# EAGLE design easy_bee_Itsybitsy (EAGLE 9.5.2)
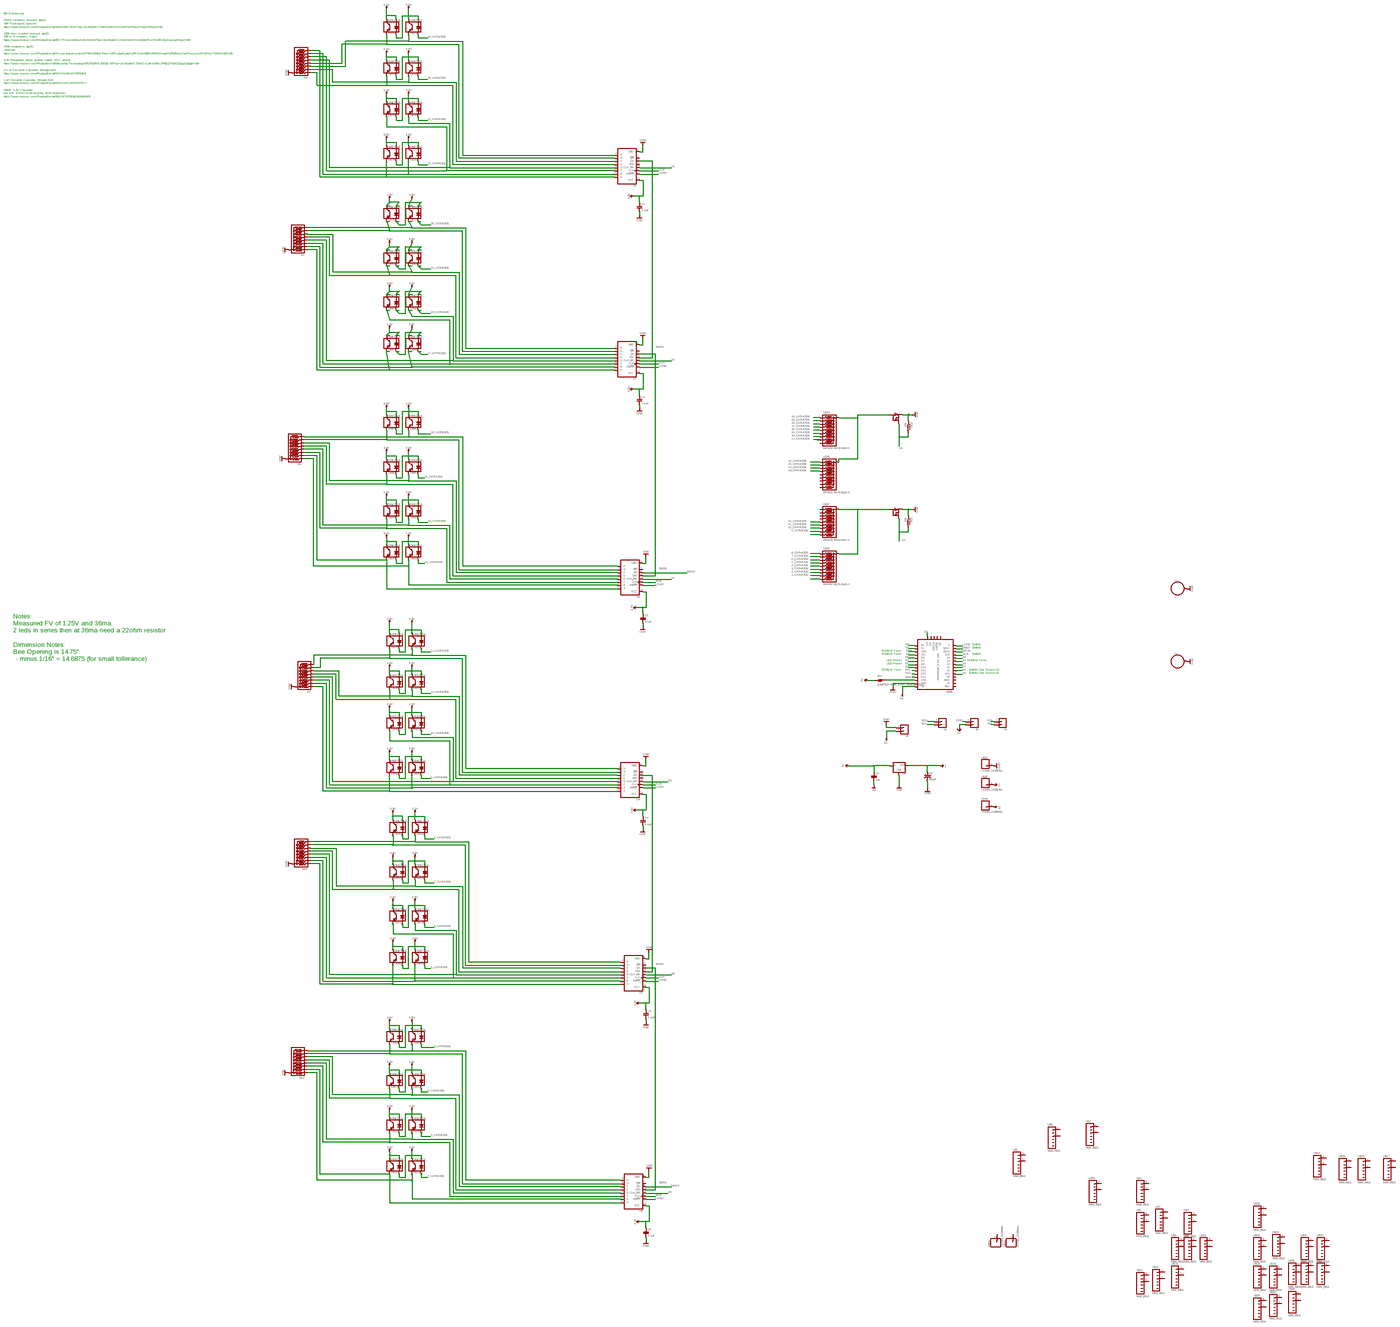
[diagram p0: schematic, sheet 1, overview]
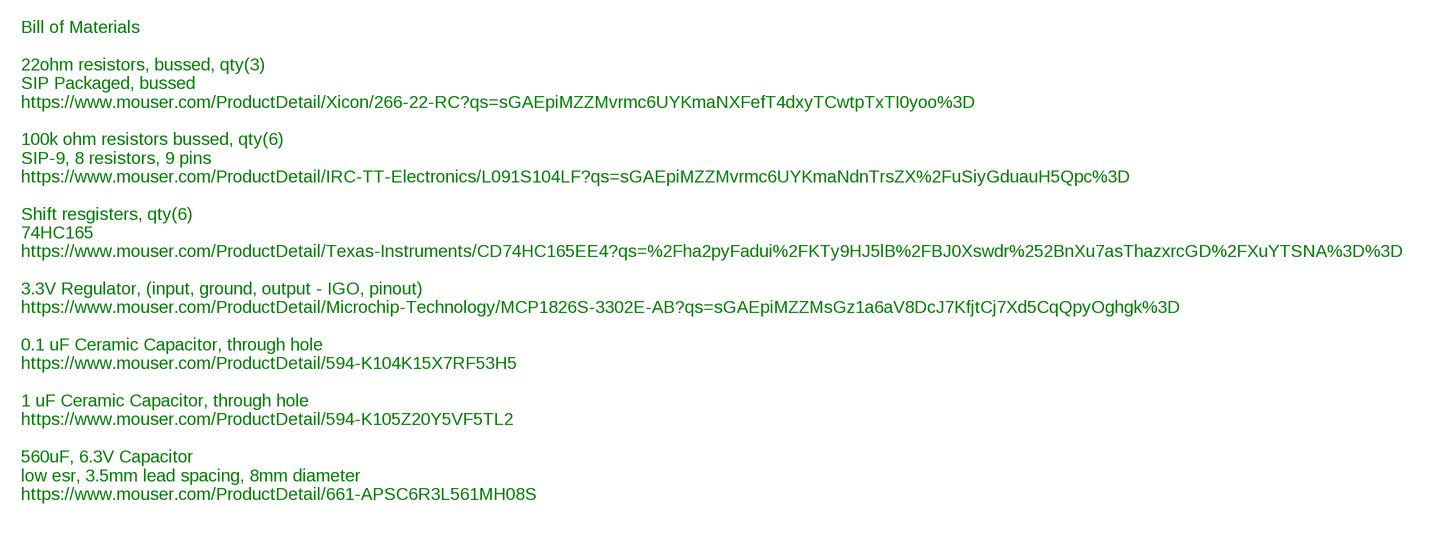
[diagram p1: schematic, sheet 1, part 1 of 5]
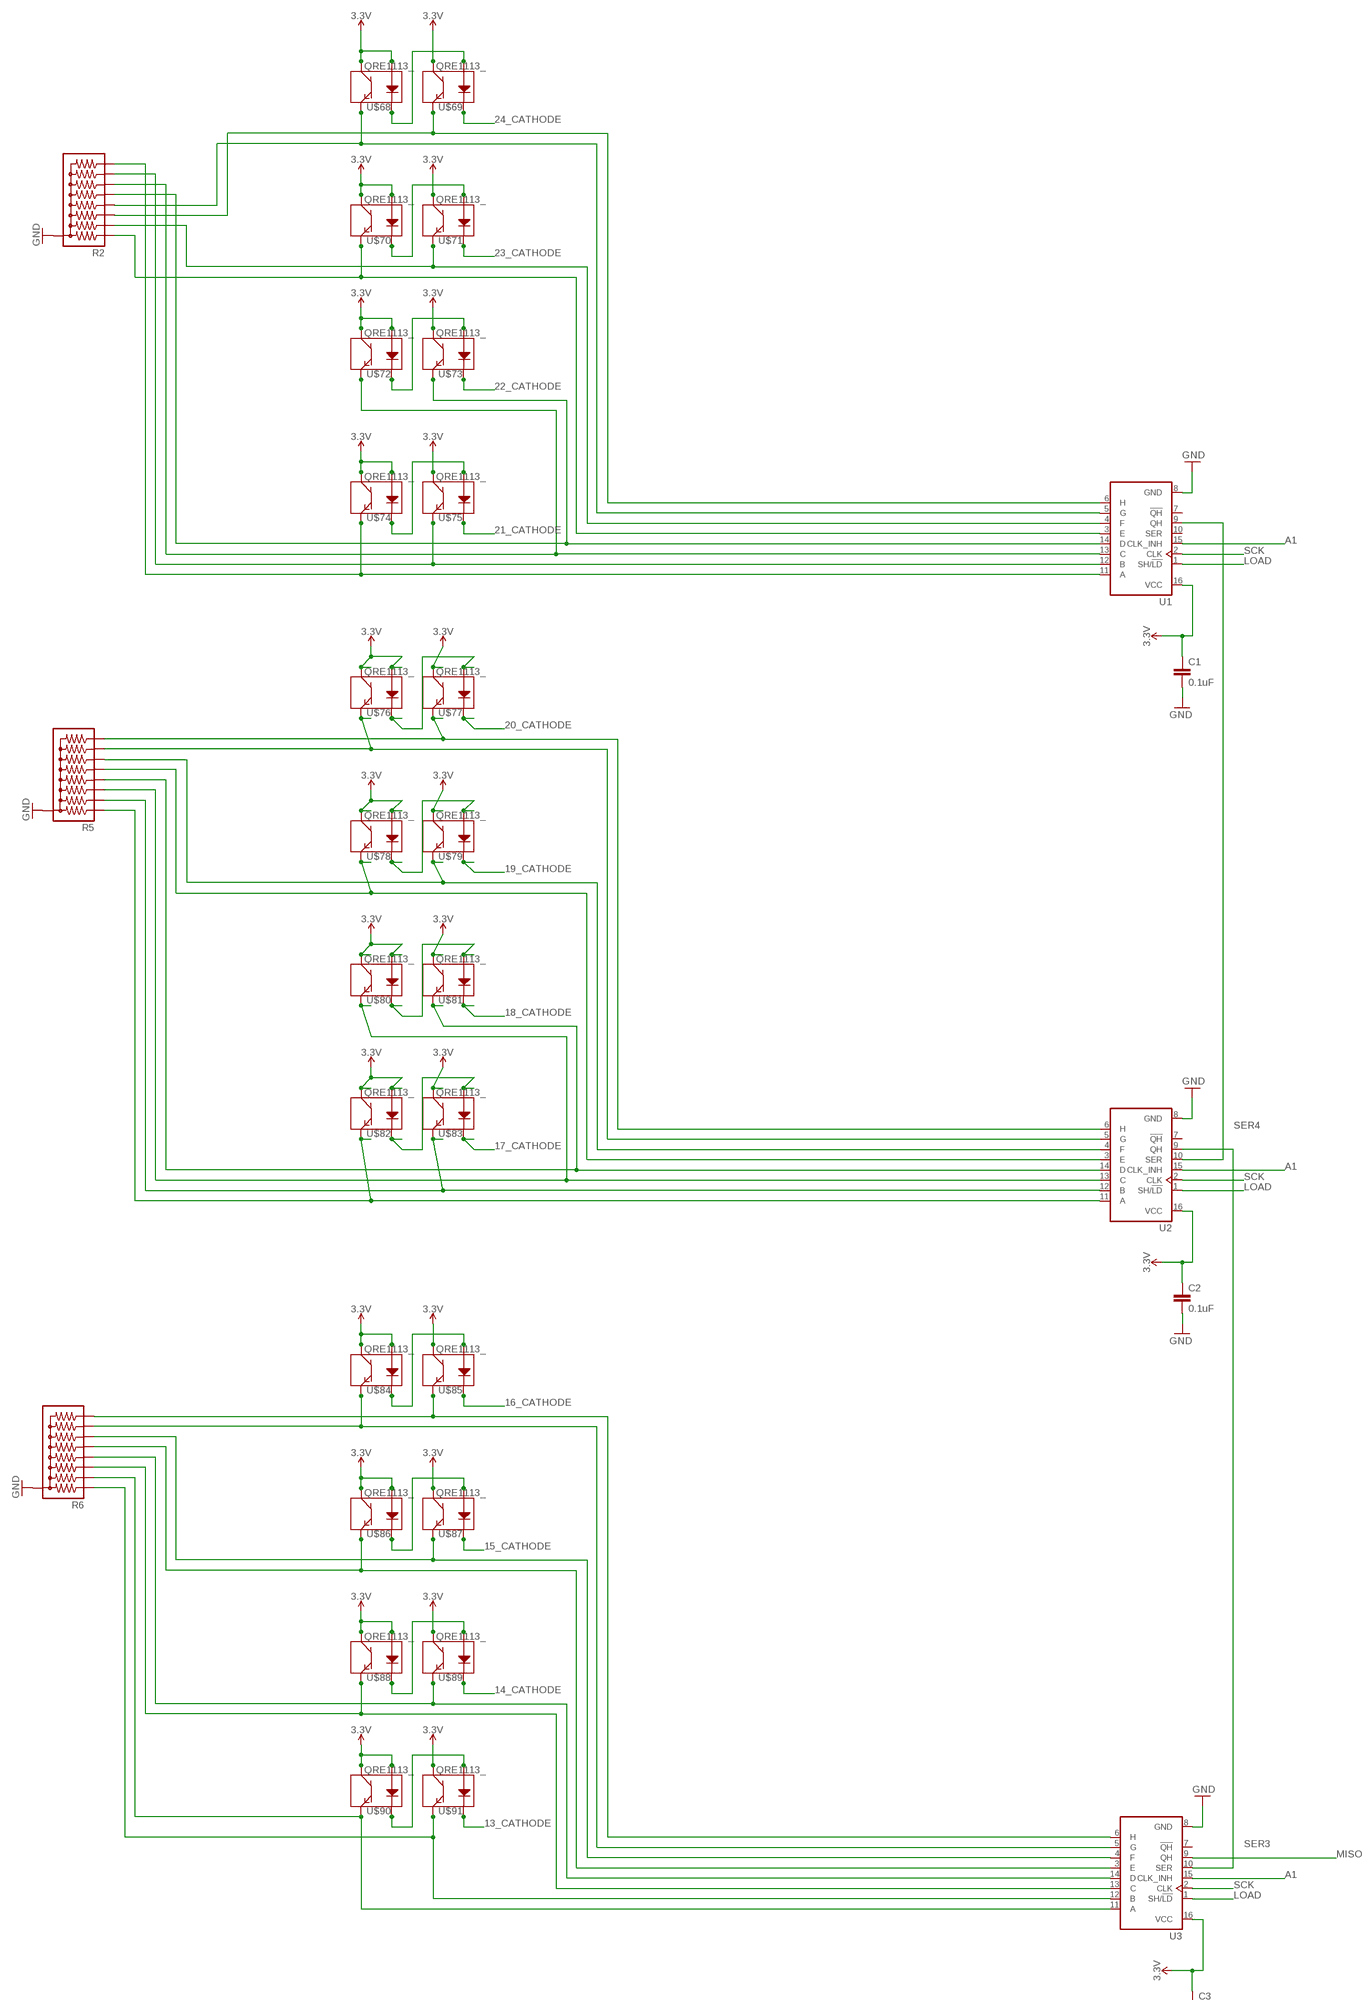
[diagram p2: schematic, sheet 1, part 2 of 5]
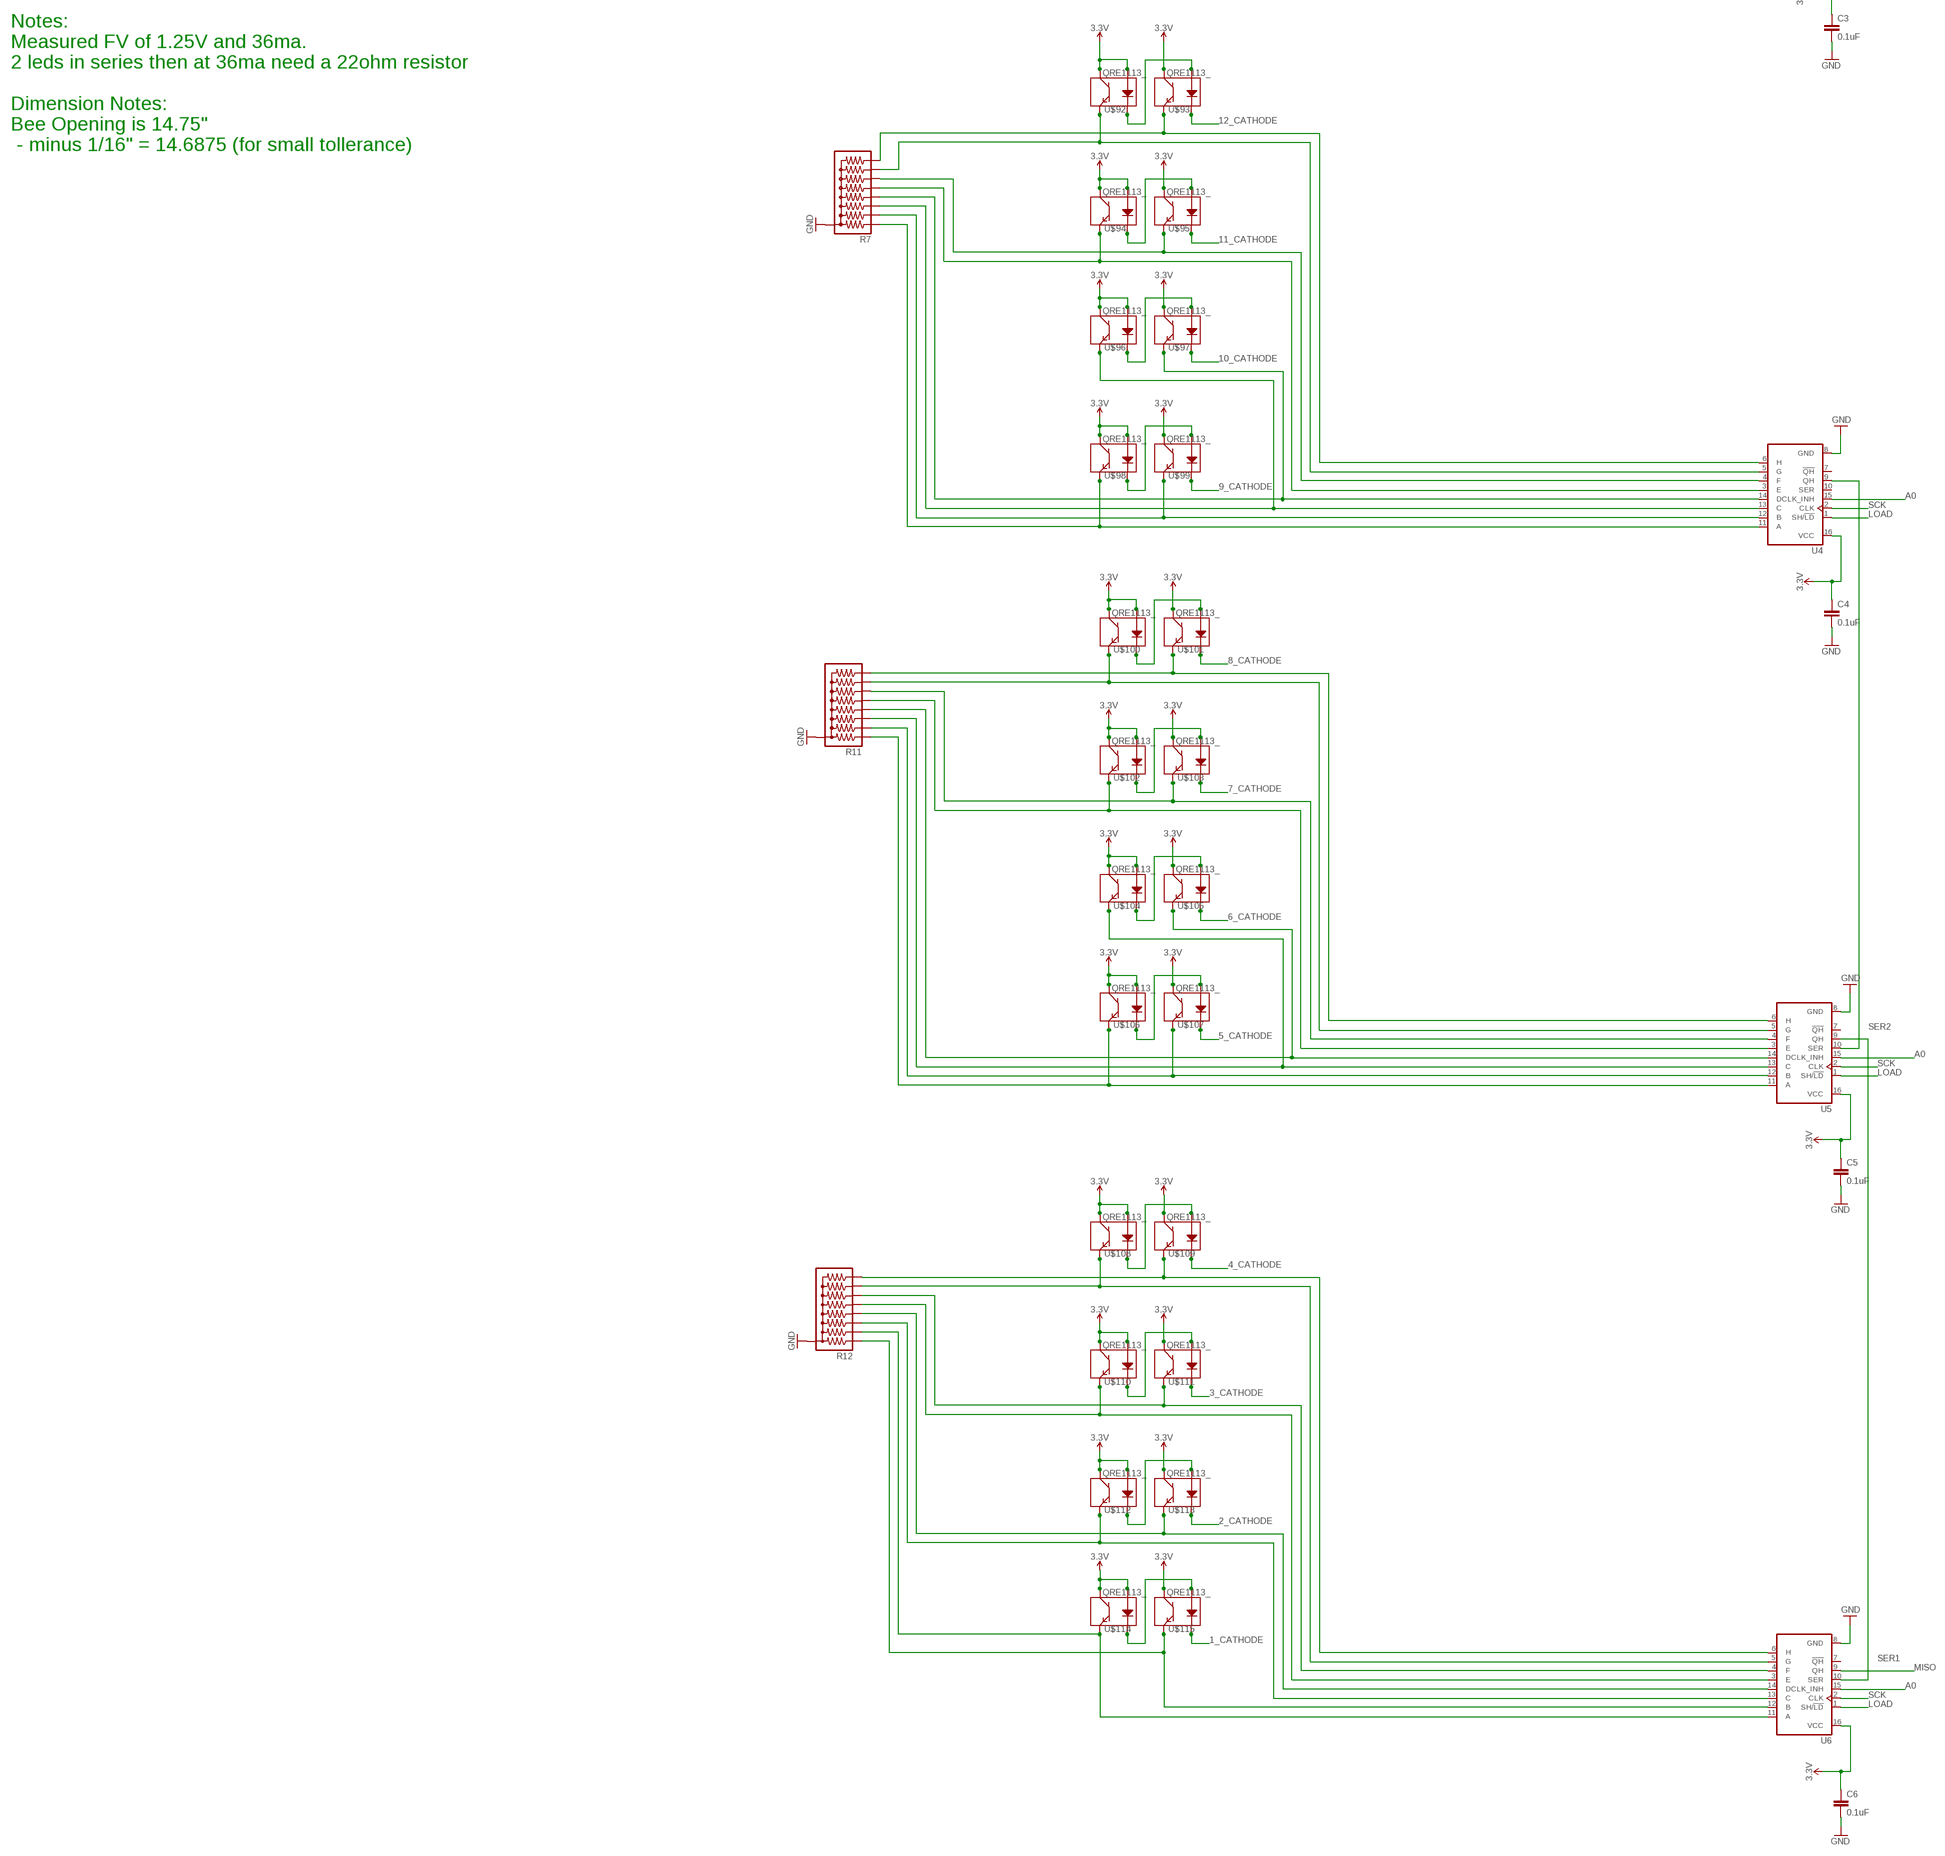
[diagram p3: schematic, sheet 1, part 3 of 5]
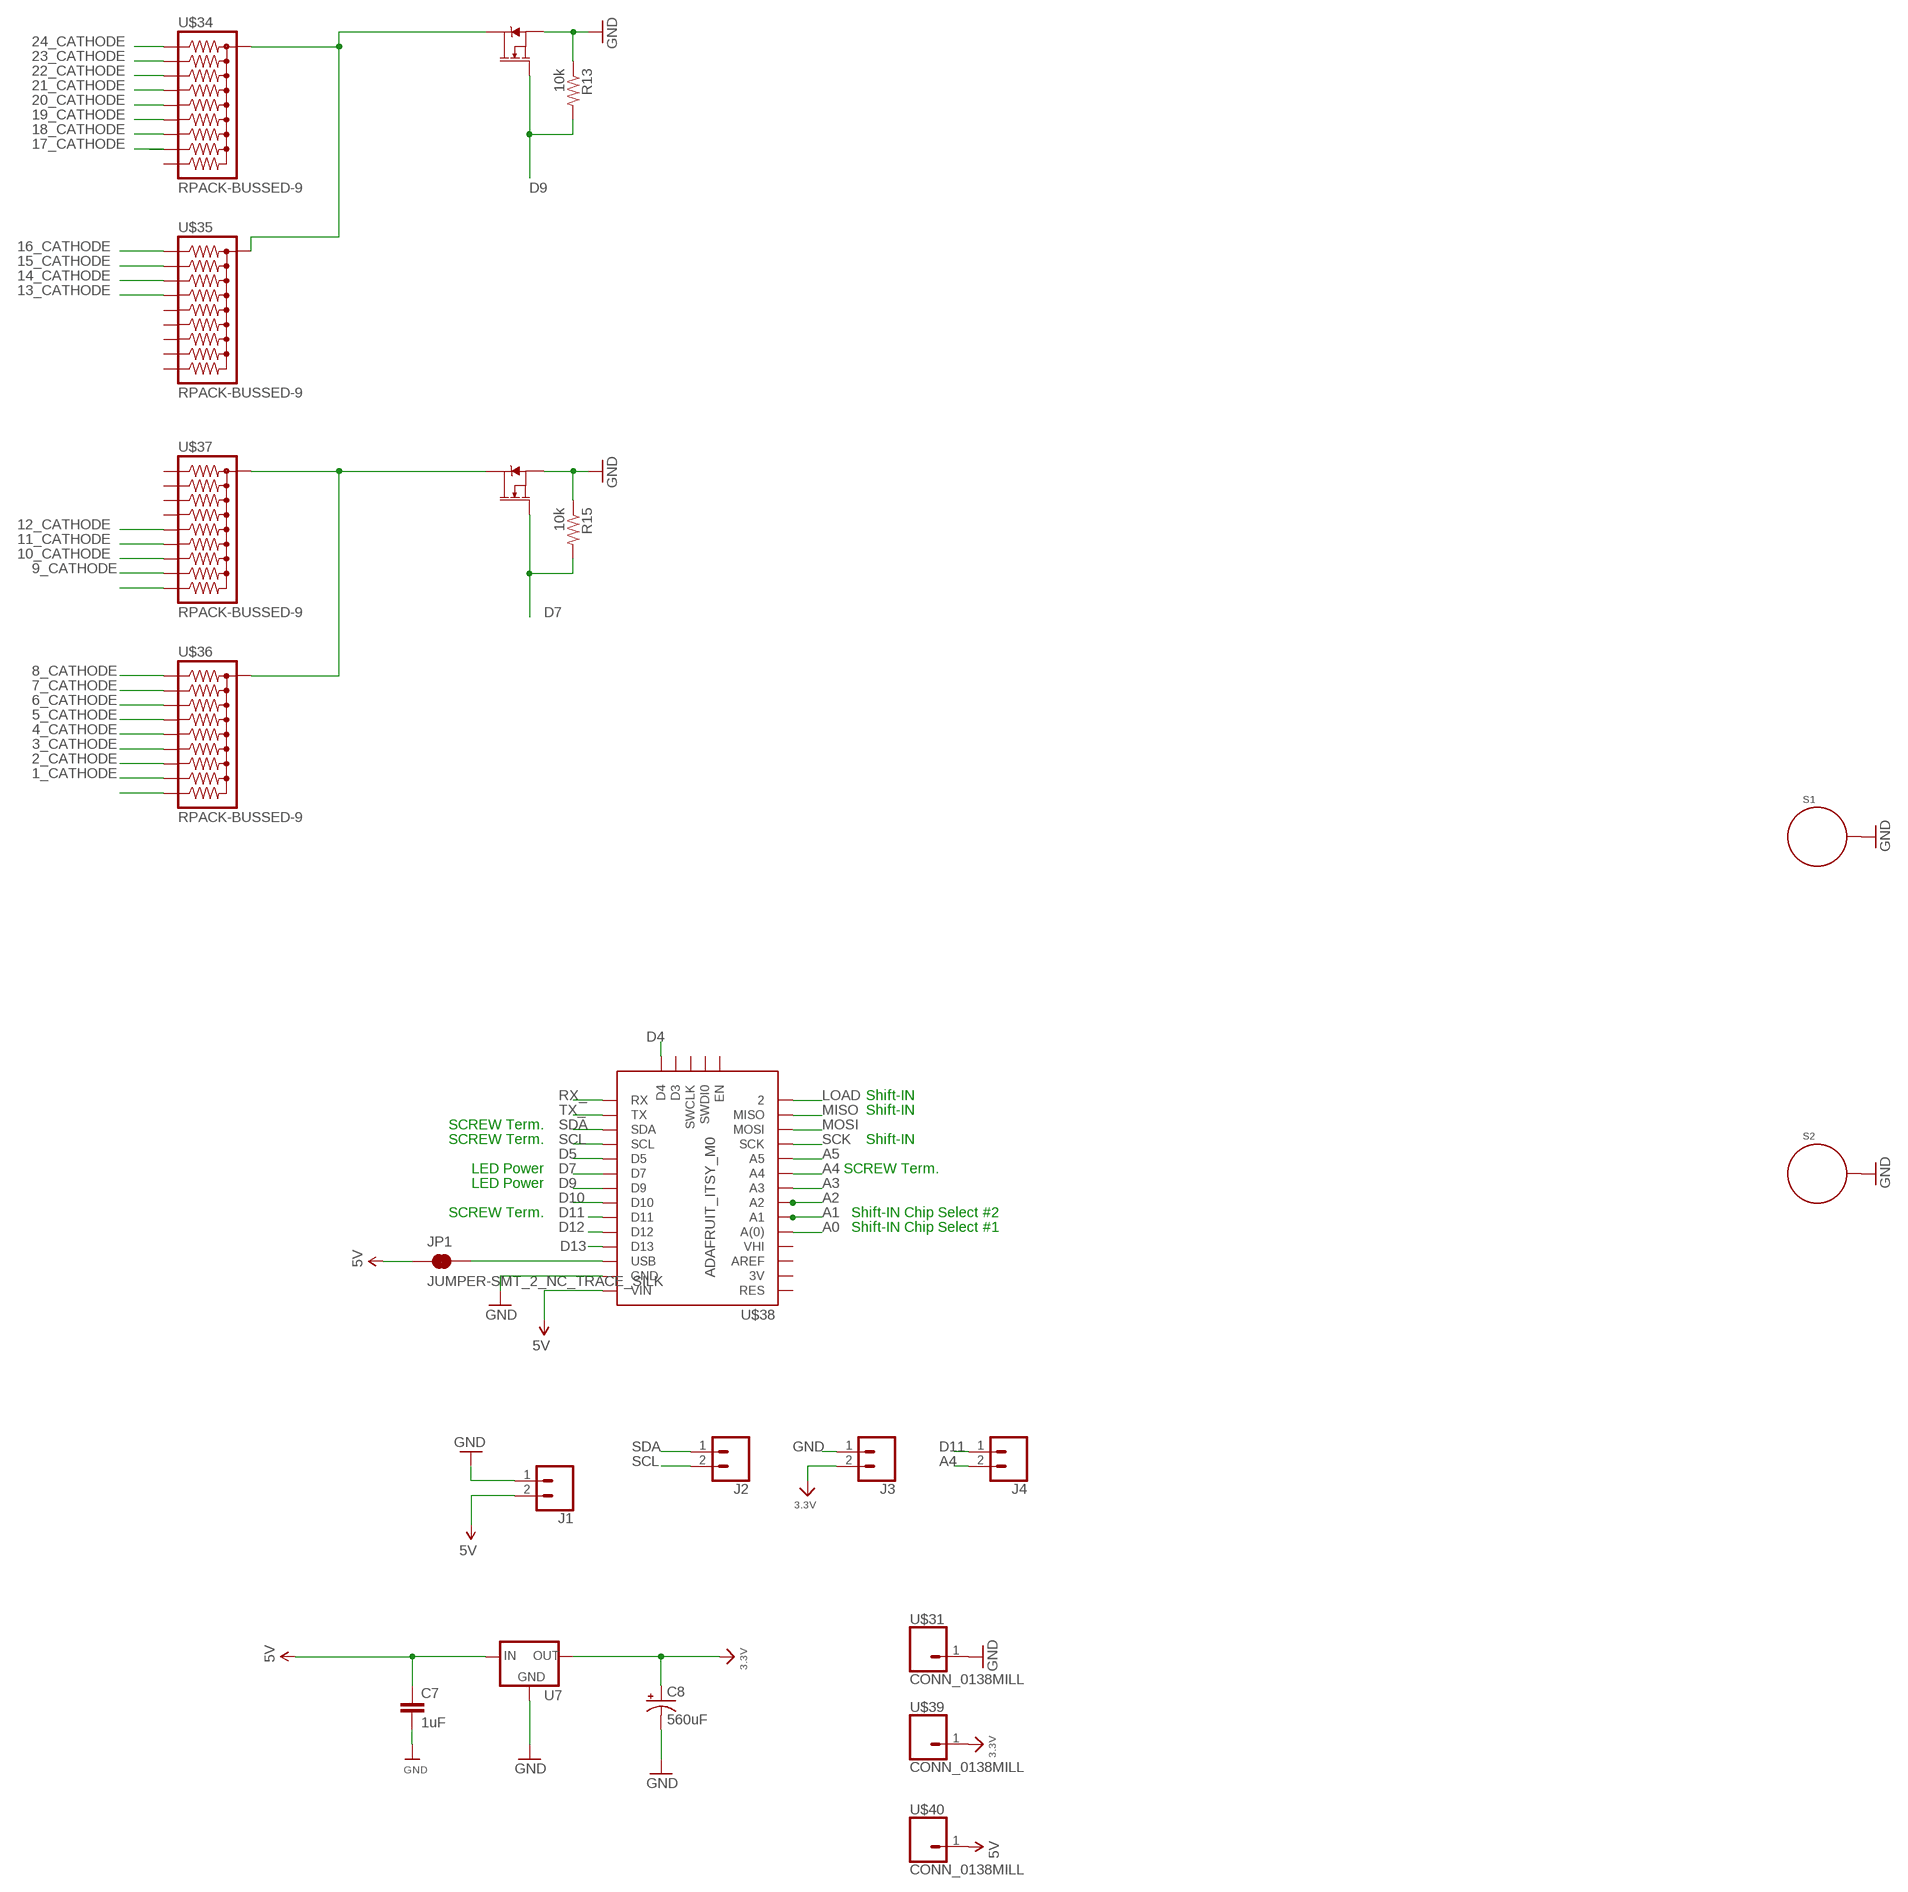
[diagram p4: schematic, sheet 1, part 4 of 5]
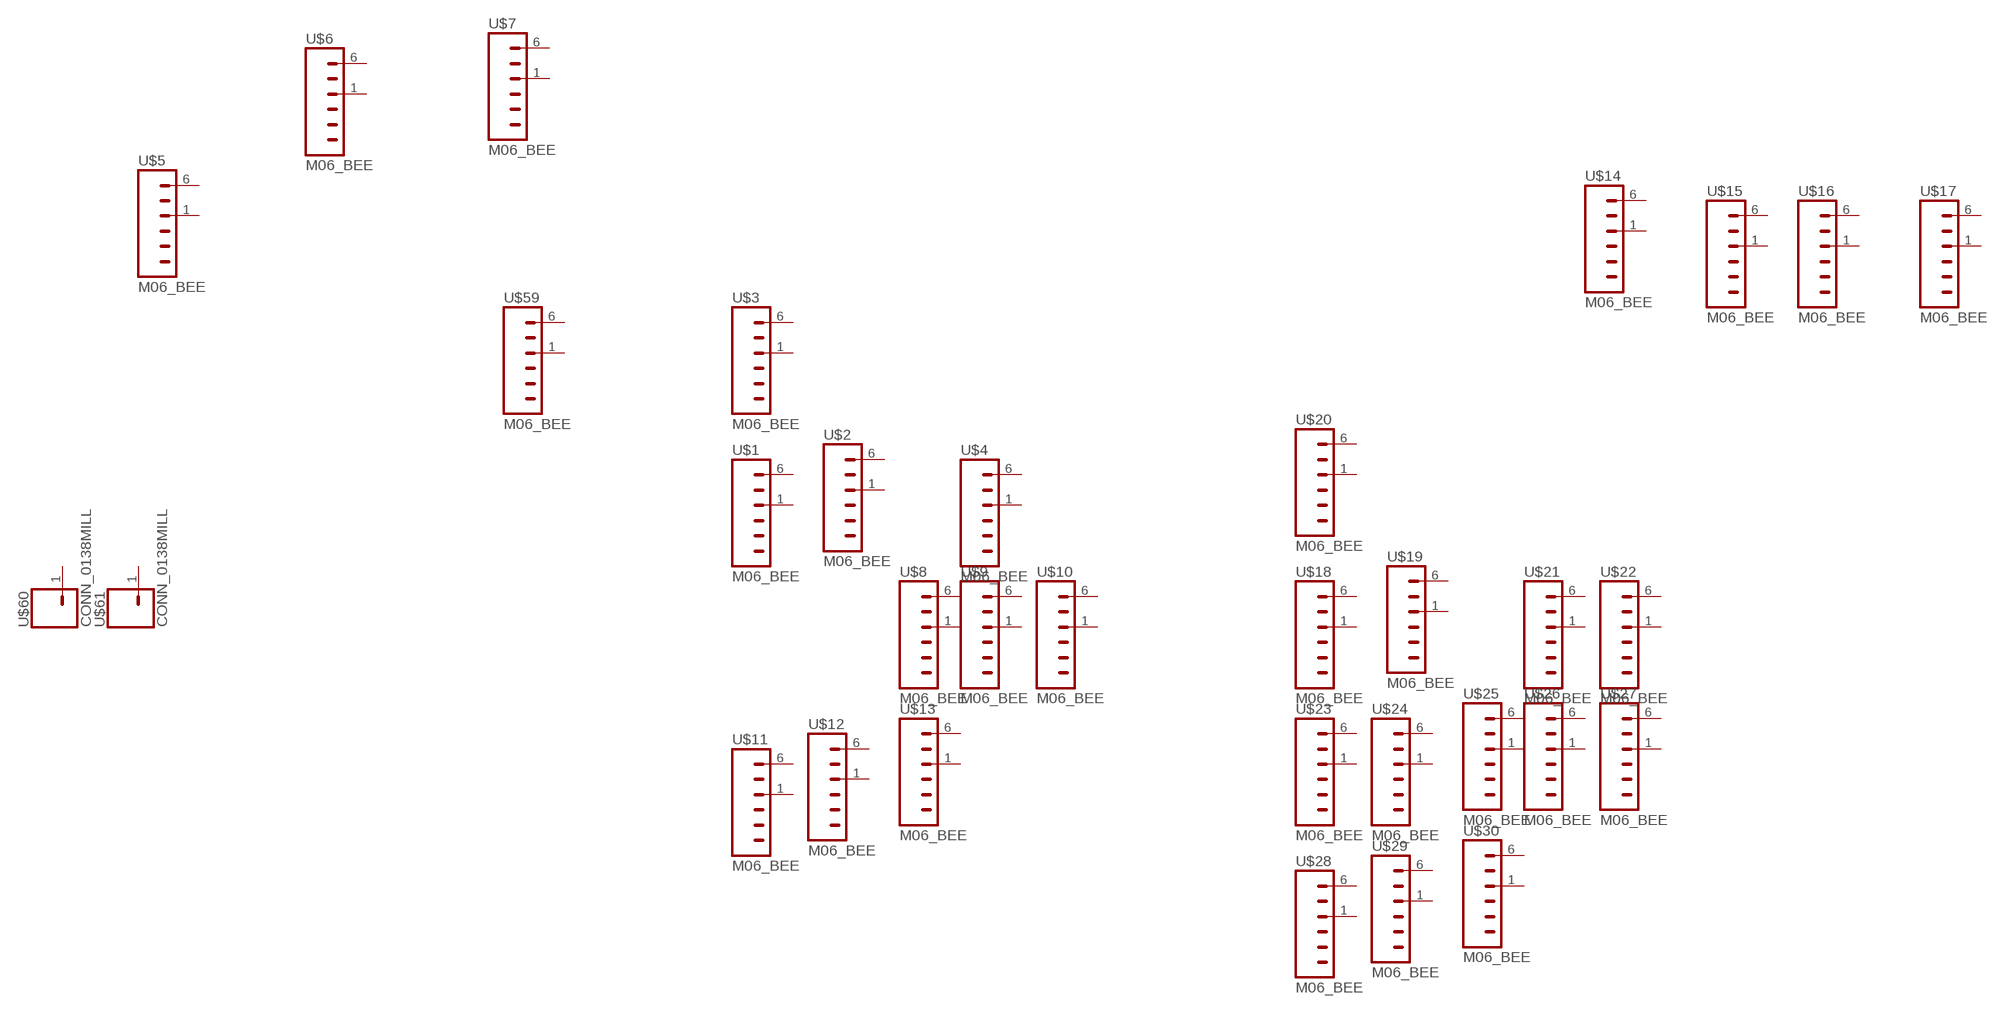
[diagram p5: schematic, sheet 1, part 5 of 5]

## Parts
C1  0.1uF  0.1UF-KIT-EZ-50V-20%  [CAP-PTH-SMALL-KIT]
C2  0.1uF  0.1UF-KIT-EZ-50V-20%  [CAP-PTH-SMALL-KIT]
C3  0.1uF  0.1UF-KIT-EZ-50V-20%  [CAP-PTH-SMALL-KIT]
C4  0.1uF  0.1UF-KIT-EZ-50V-20%  [CAP-PTH-SMALL-KIT]
C5  0.1uF  0.1UF-KIT-EZ-50V-20%  [CAP-PTH-SMALL-KIT]
C6  0.1uF  0.1UF-KIT-EZ-50V-20%  [CAP-PTH-SMALL-KIT]
C7  1uF  0.1UF-KIT-EZ-50V-20%  [CAP-PTH-SMALL-KIT]
C8  560uF  CPOL-USE3.5-8  [E3,5-8]
J1  CONN_025MM  [SCREWTERMINAL-5MM-2]
J2  CONN_025MM  [SCREWTERMINAL-5MM-2]
J3  CONN_025MM  [SCREWTERMINAL-5MM-2]
J4  CONN_025MM  [SCREWTERMINAL-5MM-2]
JP1  JUMPER-SMT_2_NC_TRACE_SILK  [SMT-JUMPER_2_NC_TRACE_SILK]
Q6  60V/32A/35mΩ  MOSFET-NCH-FQP30N06L  [TO220V]
Q7  60V/32A/35mΩ  MOSFET-NCH-FQP30N06L  [TO220V]
R2  RPACK-BUSSED-8-SIP-PTH-8  [RPACK-SIP-PTH-8]
R5  RPACK-BUSSED-8-SIP-PTH-8  [RPACK-SIP-PTH-8]
R6  RPACK-BUSSED-8-SIP-PTH-8  [RPACK-SIP-PTH-8]
R7  RPACK-BUSSED-8-SIP-PTH-8  [RPACK-SIP-PTH-8]
R11  RPACK-BUSSED-8-SIP-PTH-8  [RPACK-SIP-PTH-8]
R12  RPACK-BUSSED-8-SIP-PTH-8  [RPACK-SIP-PTH-8]
R13  10k  RESISTORAXIAL-0.3  [AXIAL-0.3]
R15  10k  RESISTORAXIAL-0.3  [AXIAL-0.3]
S1  STANDOFF_ELECTRICAL5-32  [STANDOFF_ELECTRICAL_5_32]
S2  STANDOFF_ELECTRICAL5-32  [STANDOFF_ELECTRICAL_5_32]
U1  74165  [DIP16]
U2  74165  [DIP16]
U3  74165  [DIP16]
U4  74165  [DIP16]
U5  74165  [DIP16]
U6  74165  [DIP16]
U7  V_REG_78XXSINK  [TO220-IGO]
U$1  M06_BEE  [1X06_BEE]
U$2  M06_BEE  [1X06_BEE]
U$3  M06_BEE  [1X06_BEE]
U$4  M06_BEE  [1X06_BEE]
U$5  M06_BEE  [1X06_BEE]
U$6  M06_BEE  [1X06_BEE]
U$7  M06_BEE  [1X06_BEE]
U$8  M06_BEE  [1X06_BEE]
U$9  M06_BEE  [1X06_BEE]
U$10  M06_BEE  [1X06_BEE]
U$11  M06_BEE  [1X06_BEE]
U$12  M06_BEE  [1X06_BEE]
U$13  M06_BEE  [1X06_BEE]
U$14  M06_BEE  [1X06_BEE]
U$15  M06_BEE  [1X06_BEE]
U$16  M06_BEE  [1X06_BEE]
U$17  M06_BEE  [1X06_BEE]
U$18  M06_BEE  [1X06_BEE]
U$19  M06_BEE  [1X06_BEE]
U$20  M06_BEE  [1X06_BEE]
U$21  M06_BEE  [1X06_BEE]
U$22  M06_BEE  [1X06_BEE]
U$23  M06_BEE  [1X06_BEE]
U$24  M06_BEE  [1X06_BEE]
U$25  M06_BEE  [1X06_BEE]
U$26  M06_BEE  [1X06_BEE]
U$27  M06_BEE  [1X06_BEE]
U$28  M06_BEE  [1X06_BEE]
U$29  M06_BEE  [1X06_BEE]
U$30  M06_BEE  [1X06_BEE]
U$31  CONN_0138MILL  [1X01-40MILL]
U$34  RPACK-BUSSED-9  [RPACK-SIP-PTH-9]
U$35  RPACK-BUSSED-9  [RPACK-SIP-PTH-9]
U$36  RPACK-BUSSED-9  [RPACK-SIP-PTH-9]
U$37  RPACK-BUSSED-9  [RPACK-SIP-PTH-9]
U$38  ADAFRUIT_ITSY_M0  [ADAFRUIT_ITS_M0]
U$39  CONN_0138MILL  [1X01-40MILL]
U$40  CONN_0138MILL  [1X01-40MILL]
U$59  M06_BEE  [1X06_BEE]
U$60  CONN_0138MILL  [1X01-40MILL]
U$61  CONN_0138MILL  [1X01-40MILL]
U$68  QRE1113_  [DIP400W50P180L360H200Q4]
U$69  QRE1113_  [DIP400W50P180L360H200Q4]
U$70  QRE1113_  [DIP400W50P180L360H200Q4]
U$71  QRE1113_  [DIP400W50P180L360H200Q4]
U$72  QRE1113_  [DIP400W50P180L360H200Q4]
U$73  QRE1113_  [DIP400W50P180L360H200Q4]
U$74  QRE1113_  [DIP400W50P180L360H200Q4]
U$75  QRE1113_  [DIP400W50P180L360H200Q4]
U$76  QRE1113_  [DIP400W50P180L360H200Q4]
U$77  QRE1113_  [DIP400W50P180L360H200Q4]
U$78  QRE1113_  [DIP400W50P180L360H200Q4]
U$79  QRE1113_  [DIP400W50P180L360H200Q4]
U$80  QRE1113_  [DIP400W50P180L360H200Q4]
U$81  QRE1113_  [DIP400W50P180L360H200Q4]
U$82  QRE1113_  [DIP400W50P180L360H200Q4]
U$83  QRE1113_  [DIP400W50P180L360H200Q4]
U$84  QRE1113_  [DIP400W50P180L360H200Q4]
U$85  QRE1113_  [DIP400W50P180L360H200Q4]
U$86  QRE1113_  [DIP400W50P180L360H200Q4]
U$87  QRE1113_  [DIP400W50P180L360H200Q4]
U$88  QRE1113_  [DIP400W50P180L360H200Q4]
U$89  QRE1113_  [DIP400W50P180L360H200Q4]
U$90  QRE1113_  [DIP400W50P180L360H200Q4]
U$91  QRE1113_  [DIP400W50P180L360H200Q4]
U$92  QRE1113_  [DIP400W50P180L360H200Q4]
U$93  QRE1113_  [DIP400W50P180L360H200Q4]
U$94  QRE1113_  [DIP400W50P180L360H200Q4]
U$95  QRE1113_  [DIP400W50P180L360H200Q4]
U$96  QRE1113_  [DIP400W50P180L360H200Q4]
U$97  QRE1113_  [DIP400W50P180L360H200Q4]
U$98  QRE1113_  [DIP400W50P180L360H200Q4]
U$99  QRE1113_  [DIP400W50P180L360H200Q4]
U$100  QRE1113_  [DIP400W50P180L360H200Q4]
U$101  QRE1113_  [DIP400W50P180L360H200Q4]
U$102  QRE1113_  [DIP400W50P180L360H200Q4]
U$103  QRE1113_  [DIP400W50P180L360H200Q4]
U$104  QRE1113_  [DIP400W50P180L360H200Q4]
U$105  QRE1113_  [DIP400W50P180L360H200Q4]
U$106  QRE1113_  [DIP400W50P180L360H200Q4]
U$107  QRE1113_  [DIP400W50P180L360H200Q4]
U$108  QRE1113_  [DIP400W50P180L360H200Q4]
U$109  QRE1113_  [DIP400W50P180L360H200Q4]
U$110  QRE1113_  [DIP400W50P180L360H200Q4]
U$111  QRE1113_  [DIP400W50P180L360H200Q4]
U$112  QRE1113_  [DIP400W50P180L360H200Q4]
U$113  QRE1113_  [DIP400W50P180L360H200Q4]
U$114  QRE1113_  [DIP400W50P180L360H200Q4]
U$115  QRE1113_  [DIP400W50P180L360H200Q4]

## Nets
1_CATHODE: U$36.P$9 U$115.2(K)
2_CATHODE: U$36.P$8 U$113.2(K)
3.3V: C1.1 C2.1 C3.1 C4.1 C5.1 C6.1 C8.+ J3.2 U1.16(VCC) U2.16(VCC) U3.16(VCC) U4.16(VCC) U5.16(VCC) U6.16(VCC) U7.OUT U$39.1 U$68.1(A) U$68.3(C) U$69.3(C) U$70.1(A) U$70.3(C) U$71.3(C) U$72.1(A) U$72.3(C) U$73.3(C) U$74.1(A) U$74.3(C) U$75.3(C) U$76.1(A) U$76.3(C) U$77.3(C) U$78.1(A) U$78.3(C) U$79.3(C) U$80.1(A) U$80.3(C) U$81.3(C) U$82.1(A) U$82.3(C) U$83.3(C) U$84.1(A) U$84.3(C) U$85.3(C) U$86.1(A) U$86.3(C) U$87.3(C) U$88.1(A) U$88.3(C) U$89.3(C) U$90.1(A) U$90.3(C) U$91.3(C) U$92.1(A) U$92.3(C) U$93.3(C) U$94.1(A) U$94.3(C) U$95.3(C) U$96.1(A) U$96.3(C) U$97.3(C) U$98.1(A) U$98.3(C) U$99.3(C) U$100.1(A) U$100.3(C) U$101.3(C) U$102.1(A) U$102.3(C) U$103.3(C) U$104.1(A) U$104.3(C) U$105.3(C) U$106.1(A) U$106.3(C) U$107.3(C) U$108.1(A) U$108.3(C) U$109.3(C) U$110.1(A) U$110.3(C) U$111.3(C) U$112.1(A) U$112.3(C) U$113.3(C) U$114.1(A) U$114.3(C) U$115.3(C)
3_CATHODE: U$36.P$7 U$111.2(K)
4_CATHODE: U$36.P$6 U$109.2(K)
5_CATHODE: U$36.P$5 U$107.2(K)
5V: C7.1 J1.2 JP1.1 U7.IN U$38.VIN U$40.1
6_CATHODE: U$36.P$4 U$105.2(K)
7_CATHODE: U$36.P$3 U$103.2(K)
8_CATHODE: U$36.P$2 U$101.2(K)
9_CATHODE: U$37.P$9 U$99.2(K)
10_CATHODE: U$37.P$8 U$97.2(K)
11_CATHODE: U$37.P$7 U$95.2(K)
12_CATHODE: U$37.P$6 U$93.2(K)
13_CATHODE: U$35.P$5 U$91.2(K)
14_CATHODE: U$35.P$4 U$89.2(K)
15_CATHODE: U$35.P$3 U$87.2(K)
16_CATHODE: U$35.P$2 U$85.2(K)
17_CATHODE: U$34.P$9 U$83.2(K)
18_CATHODE: U$34.P$8 U$81.2(K)
19_CATHODE: U$34.P$7 U$79.2(K)
20_CATHODE: U$34.P$6 U$77.2(K)
21_CATHODE: U$34.P$5 U$75.2(K)
22_CATHODE: U$34.P$4 U$73.2(K)
23_CATHODE: U$34.P$3 U$71.2(K)
24_CATHODE: U$34.P$2 U$69.2(K)
A0: U4.15(CLK_INH) U5.15(CLK_INH) U6.15(CLK_INH) U$38.A0(A(0))
A1: U1.15(CLK_INH) U2.15(CLK_INH) U3.15(CLK_INH) U$38.A1
A2: U$38.A2
A3: U$38.A3
A4: J4.2 U$38.A4
A5: U$38.A5
D4: U$38.D4
D5: U$38.D5
D7: Q7.1(G) R15.P$2 U$38.D7
D9: Q6.1(G) R13.P$2 U$38.D9
D10: U$38.D10
D11: J4.1 U$38.D11
D12: U$38.D12
D13: U$38.D13
GND: C1.2 C2.2 C3.2 C4.2 C5.2 C6.2 C7.2 C8.- J1.1 J3.1 Q6.3(S) Q7.3(S) R2.P$1 R5.P$1 R6.P$1 R7.P$1 R11.P$1 R12.P$1 R13.P$1 R15.P$1 S1.P1 S2.P1 U1.8(GND) U2.8(GND) U3.8(GND) U4.8(GND) U5.8(GND) U6.8(GND) U7.GND U$31.1 U$38.GND
LOAD: U1.1(SH/!LD) U2.1(SH/!LD) U3.1(SH/!LD) U4.1(SH/!LD) U5.1(SH/!LD) U6.1(SH/!LD) U$38.2
MISO: U3.9(QH) U6.9(QH) U$38.MISO
MOSI: U$38.MOSI
N$1: U$94.2(K) U$95.1(A)
N$2: U$92.2(K) U$93.1(A)
N$3: U$96.2(K) U$97.1(A)
N$4: U$98.2(K) U$99.1(A)
N$5: U$106.2(K) U$107.1(A)
N$6: U$104.2(K) U$105.1(A)
N$7: U$100.2(K) U$101.1(A)
N$8: U$108.2(K) U$109.1(A)
N$9: U$36.P$10
N$10: U$102.2(K) U$103.1(A)
N$11: U$110.2(K) U$111.1(A)
N$12: R5.P$9 U2.6(H) U$77.4(E)
N$13: U$112.2(K) U$113.1(A)
N$14: U$114.2(K) U$115.1(A)
N$15: R6.P$3 U3.11(A) U$90.4(E)
N$16: R6.P$2 U3.12(B) U$91.4(E)
N$17: R6.P$4 U3.13(C) U$88.4(E)
N$18: R12.P$6 U6.3(E) U$110.4(E)
N$19: R6.P$5 U3.14(D) U$89.4(E)
N$20: R6.P$8 U3.5(G) U$84.4(E)
N$21: Q6.2(D) U$34.P$1 U$35.P$1
N$22: R6.P$9 U3.6(H) U$85.4(E)
N$23: R6.P$6 U3.3(E) U$86.4(E)
N$24: R6.P$7 U3.4(F) U$87.4(E)
N$25: R5.P$4 U2.13(C) U$80.4(E)
N$26: R5.P$5 U2.14(D) U$81.4(E)
N$27: R5.P$8 U2.5(G) U$76.4(E)
N$29: R5.P$6 U2.3(E) U$78.4(E)
N$30: R12.P$3 U6.11(A) U$114.4(E)
N$32: R5.P$7 U2.4(F) U$79.4(E)
N$33: R5.P$3 U2.12(B) U$83.4(E)
N$34: R7.P$4 U4.13(C) U$96.4(E)
N$35: R5.P$2 U2.11(A) U$82.4(E)
N$36: R2.P$7 U1.13(C) U$72.4(E)
N$37: R2.P$6 U1.14(D) U$73.4(E)
N$38: R2.P$5 U1.5(G) U$68.4(E)
N$39: R2.P$4 U1.6(H) U$69.4(E)
N$40: R2.P$2 U1.3(E) U$70.4(E)
N$41: R2.P$3 U1.4(F) U$71.4(E)
N$42: R2.P$8 U1.12(B) U$75.4(E)
N$43: R2.P$9 U1.11(A) U$74.4(E)
N$45: U$68.2(K) U$69.1(A)
N$46: U$70.2(K) U$71.1(A)
N$47: U$72.2(K) U$73.1(A)
N$48: U$74.2(K) U$75.1(A)
N$49: U$82.2(K) U$83.1(A)
N$50: U$80.2(K) U$81.1(A)
N$51: U$76.2(K) U$77.1(A)
N$52: U$78.2(K) U$79.1(A)
N$53: U$84.2(K) U$85.1(A)
N$54: U$86.2(K) U$87.1(A)
N$55: U$88.2(K) U$89.1(A)
N$56: U$90.2(K) U$91.1(A)
N$58: R12.P$7 U6.4(F) U$111.4(E)
N$62: R7.P$8 U4.5(G) U$92.4(E)
N$63: Q7.2(D) U$36.P$1 U$37.P$1
N$65: R7.P$6 U4.3(E) U$94.4(E)
N$68: R7.P$2 U4.11(A) U$98.4(E)
N$71: U$37.P$10
N$74: R11.P$3 U5.12(B) U$107.4(E)
N$87: R12.P$2 U6.12(B) U$115.4(E)
N$89: R11.P$4 U5.13(C) U$104.4(E)
N$91: R11.P$8 U5.5(G) U$100.4(E)
N$93: R11.P$6 U5.3(E) U$102.4(E)
N$97: R11.P$2 U5.11(A) U$106.4(E)
N$101: R12.P$4 U6.13(C) U$112.4(E)
N$102: R12.P$5 U6.14(D) U$113.4(E)
N$105: R11.P$5 U5.14(D) U$105.4(E)
N$108: R12.P$8 U6.5(G) U$108.4(E)
N$109: R12.P$9 U6.6(H) U$109.4(E)
N$112: R11.P$9 U5.6(H) U$101.4(E)
N$117: R11.P$7 U5.4(F) U$103.4(E)
N$131: R7.P$5 U4.14(D) U$97.4(E)
N$135: R7.P$9 U4.6(H) U$93.4(E)
N$140: R7.P$7 U4.4(F) U$95.4(E)
N$141: R7.P$3 U4.12(B) U$99.4(E)
RX_: U$38.RX
SCK: U1.2(CLK) U2.2(CLK) U3.2(CLK) U4.2(CLK) U5.2(CLK) U6.2(CLK) U$38.SCK
SCL: J2.2 U$38.SCL
SDA: J2.1 U$38.SDA
SER1: U5.9(QH) U6.10(SER)
SER2: U4.9(QH) U5.10(SER)
SER3: U2.9(QH) U3.10(SER)
SER4: U1.9(QH) U2.10(SER)
TX_: U$38.TX
USB: JP1.2 U$38.USB
Unconnected: U1.7(!QH) U1.10(SER) U2.7(!QH) U3.7(!QH) U4.7(!QH) U4.10(SER) U5.7(!QH) U6.7(!QH) U$1.1 U$1.6 U$2.1 U$2.6 U$3.1 U$3.6 U$4.1 U$4.6 U$5.1 U$5.6 U$6.1 U$6.6 U$7.1 U$7.6 U$8.1 U$8.6 U$9.1 U$9.6 U$10.1 U$10.6 U$11.1 U$11.6 U$12.1 U$12.6 U$13.1 U$13.6 U$14.1 U$14.6 U$15.1 U$15.6 U$16.1 U$16.6 U$17.1 U$17.6 U$18.1 U$18.6 U$19.1 U$19.6 U$20.1 U$20.6 U$21.1 U$21.6 U$22.1 U$22.6 U$23.1 U$23.6 U$24.1 U$24.6 U$25.1 U$25.6 U$26.1 U$26.6 U$27.1 U$27.6 U$28.1 U$28.6 U$29.1 U$29.6 U$30.1 U$30.6 U$34.P$10 U$35.P$6 U$35.P$7 U$35.P$8 U$35.P$9 U$35.P$10 U$37.P$2 U$37.P$3 U$37.P$4 U$37.P$5 U$38.3(D3) U$38.3V U$38.AREF U$38.EN U$38.RES U$38.SWCLK U$38.SWDI0 U$38.VHI U$59.1 U$59.6 U$60.1 U$61.1

## Notes on the sheet
- Bill of Materials
  
  22ohm resistors, bussed, qty(3)
  SIP Packaged, bussed
  https://www.mouser.com/ProductDetail/Xicon/266-22-RC?qs=sGAEpiMZZMvrmc6UYKmaNXFefT4dxyTCwtpTxTI0yoo%3D
  
  100k ohm resistors bussed, qty(6)
  SIP-9, 8 resistors, 9 pins
  https://www.mouser.com/ProductDetail/IRC-TT-Electronics/L091S104LF?qs=sGAEpiMZZMvrmc6UYKmaNdnTrsZX%2FuSiyGduauH5Qpc%3D
  
  Shift resgisters, qty(6)
  74HC165
  https://www.mouser.com/ProductDetail/Texas-Instruments/CD74HC165EE4?qs=%2Fha2pyFadui%2FKTy9HJ5lB%2FBJ0Xswdr%252BnXu7asThazxrcGD%2FXuYTSNA%3D%3D
  
  3.3V Regulator, (input, ground, output - IGO, pinout)
  https://www.mouser.com/ProductDetail/Microchip-Technology/MCP1826S-3302E-AB?qs=sGAEpiMZZMsGz1a6aV8DcJ7KfjtCj7Xd5CqQpyOghgk%3D
  
  0.1 uF Ceramic Capacitor, through hole
  https://www.mouser.com/ProductDetail/594-K104K15X7RF53H5
  
  1 uF Ceramic Capacitor, through hole
  https://www.mouser.com/ProductDetail/594-K105Z20Y5VF5TL2
  
  560uF, 6.3V Capacitor
  low esr, 3.5mm lead spacing, 8mm diameter
  https://www.mouser.com/ProductDetail/661-APSC6R3L561MH08S
- Shift-IN
- Shift-IN
- SCREW Term.
- SCREW Term. | Shift-IN
- Notes:
  Measured FV of 1.25V and 36ma.
  2 leds in series then at 36ma need a 22ohm resistor
  
  Dimension Notes:
  Bee Opening is 14.75"
   - minus 1/16" = 14.6875 (for small tollerance)
- LED Power | SCREW Term.
- LED Power
- SCREW Term. | Shift-IN Chip Select #2
- Shift-IN Chip Select #1

## Library data of the parts
C1-C6 = SparkFun-Capacitors:0.1UF: 0.1µF ceramic capacitors A capacitor is a passive two-terminal electrical component used to store electrical energy temporarily in an electric field.; PROD_ID: CAP-08370
C7 = SparkFun-Capacitors:0.1UF: 0.1µF ceramic capacitors A capacitor is a passive two-terminal electrical component used to store electrical energy temporarily in an electric field.; PROD_ID: CAP-08370; VALUE: 0.1uF
C8 = rcl:CPOL-US: POLARIZED CAPACITOR, American symbol; SPICEPREFIX: C
J1-J4 = SparkFun-Connectors:CONN_02: Multi connection point. Often used as Generic Header-pin footprint for 0.1 inch spaced/style header connections On any of the 0.1 inch spaced packages, you can populate with these: Break Away Headers - Straight <https://www.sparkfun.com/products/116> (PRT-00116) Break Away Male Headers - Right Angle <https://www.sparkfun.com/products/553> (PRT-00553) Female Headers <https://www.sparkfun.com/products/115> (PRT-00115) Break Away Headers - Machine Pin <https://www.sparkfun.com/products/117> (PRT-00117) Break Away Female Headers - Swiss Machine Pin <https://www.sparkfun.com/products/743> (PRT-00743) For SCREWTERMINALS and SPRING TERMINALS visit here: Screw Terimnals on SparkFun.com <https://www.sparkfun.com/search/results?term=Screw+Terminals> (5mm/3.5mm/2.54mm spacing) This device is also useful as a general connection point to wire up your design to another part of your project. Our various solder wires solder well into these plated through hole pads. Hook-Up Wire - Assortment (Stranded, 22 AWG) <https://www.sparkfun.com/products/11375> (PRT-11375) Hook-Up Wire - Assortment (Solid Core, 22 AWG) <https://www.sparkfun.com/products/11367> (PRT-11367) View the entire wire category on our website here <https://www.sparkfun.com/categories/141> Special notes: Molex polarized connector foot print use with: PRT-08233 with associated crimp pins and housings. 2.54_SCREWTERM for use with PRT-10571. 3.5mm Screw Terminal footprints for PRT-08084 5mm Screw Terminal footprints for use with PRT-08432; SF_SKU: PRT-08432
JP1 = SparkFun-Jumpers:JUMPER-SMT_2_NC_TRACE: Normally closed trace jumper This jumper has a trace between two pads so it's normally closed (NC). Use a razor knife to open the connection. For best results follow the IPC guidelines for cutting traces: Cutout at least 0.063 mm (0.005 in). Remove all loose material to clean up the cut area. Seal the cut with an approved epoxy. Reapply solder to reclose the connection.
Q6 Q7 = th_libraries:MOSFET-NCH: N-channel MOSFETs Voltage controlled devices that allow control of high current outputs. SparkFun Products: SparkFun OpenScale <https://www.sparkfun.com/products/13261> SparkFun Digital Sandbox <https://www.sparkfun.com/products/12651> SparkFun Monster Moto Shield <https://www.sparkfun.com/products/10182> SparkFun MOSFET Power Controller <https://www.sparkfun.com/products/11214>; PROD_ID: TRANS-10060
R2 R5-R7 R11 R12 = th_libraries:RPACK-BUSSED-8: BOURNS 4600X/R series thick-film SIP resistor packs Height resistors bussed to a single pin (denoted by dot). datasheet <http://dlnmh9ip6v2uc.cloudfront.net/datasheets/Components/General/4600x.pdf> SIMILAR TO: SFE parts COM-10855 (330), COM-10856 (10K)
R13 R15 = SparkFun-Passives:RESISTOR: Resistor Basic schematic elements and footprints for 0603, 1206, and PTH resistors.
S1 S2 = th_libraries:STANDOFF_ELECTRICAL: A standoff intended to be an electrically connected point. Pad size and stop size allow for a #8 Phillips pan screw head to make a solid connection to the board. Added 144mill drill hole that fits my normal wood screw
U1-U6 = th_libraries:74*165: 8-Bit Shift Register (Parallel to Serial) Datasheet <https://cdn.sparkfun.com/datasheets/BreakoutBoards/sn54hc165.pdf> SparkFun Products SparkFun Shift-In Breakout - SN74HC165 <https://www.sparkfun.com/products/11733> (BOB-11733)
U7 = SparkFun-IC-Power:V_REG_78XX: Voltage Regulator Standard 78xx regulator. IGO (Input Ground Output). Spark Fun Electronics SKU : COM-00107
U$1-U$30 U$59 = Bee Counter 3:M06_BEE
U$31 U$39 U$40 U$60 U$61 = th_libraries3:CONN_01
U$34-U$37 = th_libraries:RPACK-BUSSED-9: used in easy bee 10pins, 9 resistors, common buss Bourns https://www.mouser.com/ProductDetail/Bourns/4610X-101-220LF?qs=sGAEpiMZZMvrmc6UYKmaNVMVEQDzqD4WvYds4mFxwCY%3D Xicon https://www.mouser.com/ProductDetail/Xicon/266-22-RC?qs=sGAEpiMZZMvrmc6UYKmaNXFefT4dxyTCwtpTxTI0yoo%3D
U$38 = th_libraries:ADAFRUIT_ITSY_M0
U$68-U$115 = QRE1113:QRE1113_: Reflective object sensor

## Net classes
1 gnd: width 0.635 mm, drill 0.635 mm, clearance 0.254 mm
2 vcc: width 0.406 mm, drill 0.406 mm, clearance 0.254 mm

## Board
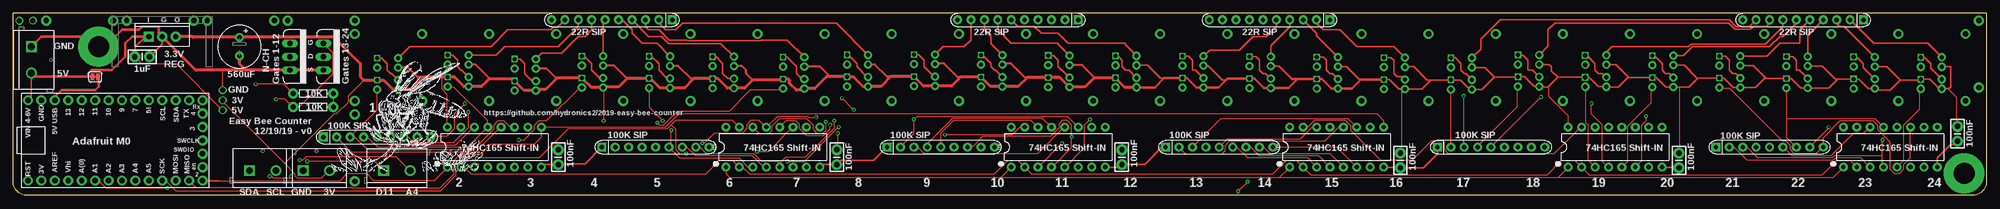
[diagram p6: board, top side]
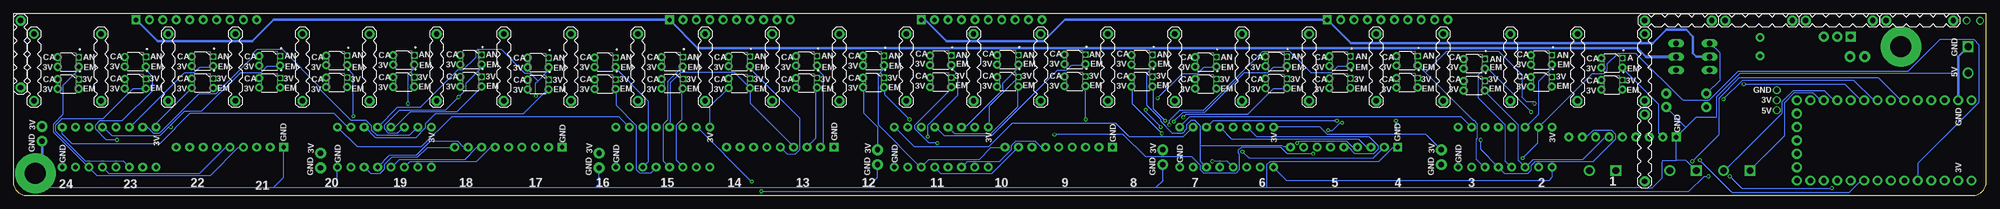
[diagram p7: board, bottom side, seen from below]

Size 373.39 x 34.54 mm. Coordinates in mm from the lower left corner, seen from the top.
Outline: 373.39,34.54 0,34.54 0,2.54 arc90 2.54,0 370.85,0 arc90 373.39,2.54 373.39,34.54
Copper layers (1*16): Top 0.0356mm / dielectric 1.5011mm / Bottom 0.0356mm
Design rules "default *": minimum track width 8mil, minimum drill 13mil, track to track 8mil, track to pad 8mil, pad to pad 8mil, via to via 8mil, smd to smd 8mil, copper to edge 15mil, drill to drill 6mil, minimum pad ring 7mil, minimum via ring 7mil, stop-mask expansion 4mil, vias tented up to drill 25mil, thermal gap 10mil

### Footprints (pad centres in the part's own frame; a part is rotated, then mirrored left to right if it is on the bottom)
CAP-PTH-SMALL-KIT = drill 1.016 pad 2.032: 1 -1.397,0; 2 1.397,0
E3,5-8 = drill 0.813 pad 1.6: + -1.778,0 | drill 0.813 pad 1.6 octagon: - 1.778,0
SCREWTERMINAL-5MM-2 = drill 1.3 pad 2.032 square: 1 0,0 | drill 1.3 pad 2.032: 2 5,0
SMT-JUMPER_2_NC_TRACE_SILK = smd 0.635 x 1.27: 1 -0.508,0; 2 0.508,0
TO220V = drill 1.016 long: 1 -2.54,0; 2 0,0; 3 2.54,0
RPACK-SIP-PTH-8 = drill 0.8 pad 1.676 square: P$1 0,0 | drill 0.8 pad 1.676: P$2 0,-2.54; P$3 0,-5.08; P$4 0,-7.62; P$5 0,-10.16; P$6 0,-12.7; P$7 0,-15.24; P$8 0,-17.78; P$9 0,-20.32
AXIAL-0.3 = drill 0.9 pad 1.88: P$1 -3.81,0; P$2 3.81,0
STANDOFF_ELECTRICAL_5_32 = drill 3.969 pad 7.62: P1 0,0
DIP16 = drill 0.813 pad 1.626: 1 -8.89,-3.81; 2 -6.35,-3.81; 3 -3.81,-3.81; 4 -1.27,-3.81; 5 1.27,-3.81; 6 3.81,-3.81; 7 6.35,-3.81; 8 8.89,-3.81; 9 8.89,3.81; 10 6.35,3.81; 11 3.81,3.81; 12 1.27,3.81; 13 -1.27,3.81; 14 -3.81,3.81; 15 -6.35,3.81; 16 -8.89,3.81
TO220-IGO = drill 1 pad 1.88: GND 0,0; OUT 2.54,0 | drill 1 pad 1.88 square: IN -2.54,0
1X06_BEE = drill 1.016 pad 1.88: 1 -2.54,0; 6 10.16,0
1X01-40MILL = drill 0.965 pad 1.397: 1 0,0
RPACK-SIP-PTH-9 = drill 0.8 pad 1.676 square: P$1 0,11.43 | drill 0.8 pad 1.676: P$2 0,8.89; P$3 0,6.35; P$4 0,3.81; P$5 0,1.27; P$6 0,-1.27; P$7 0,-3.81; P$8 0,-6.35; P$9 0,-8.89; P$10 0,-11.43
ADAFRUIT_ITS_M0 = drill 1.016 pad 1.88: 2 -7.62,-12.7; 3 2.54,-12.7; 3V -7.62,17.78; A0 -7.62,10.16; A1 -7.62,7.62; A2 -7.62,5.08; A3 -7.62,2.54; A4 -7.62,0; A5 -7.62,-2.54; AREF -7.62,15.24; D4 5.08,-12.7; D5 7.62,-2.54; D7 7.62,0; D9 7.62,2.54; D10 7.62,5.08; D11 7.62,7.62; D12 7.62,10.16; D13 7.62,12.7; EN -5.08,-12.7; GND 7.62,17.78; MISO -7.62,-10.16; MOSI -7.62,-7.62; RES -7.62,20.32; RX 7.62,-12.7; SCK -7.62,-5.08; SCL 7.62,-5.08; SDA 7.62,-7.62; SWCLK 0,-12.7; SWDI0 -2.54,-12.7; TX 7.62,-10.16; USB 7.62,15.24; VHI -7.62,12.7; VIN 7.62,20.32
DIP400W50P180L360H200Q4 = drill 0.78 square: 1 -0.9,2 | drill 0.78 pad 1.524: 2 -0.9,-2; 3 0.9,-2; 4 0.9,2

### Placement (x,y rotation side)
C1  367.93,11.68 270 top
C2  315.22,6.6 270 top
C3  262.52,6.6 270 top
C4  209.81,7.24 270 top
C5  155.84,7.24 270 top
C6  103.13,7.24 270 top
C7  24.39,26.29 0 top
C8  42.81,28.19 270 top
J1  3.44,28.19 270 top
J2  44.71,4.7 0 top
J3  54.87,4.7 0 top
J4  70.11,4.7 0 top
JP1  15.5,22.48 0 top
Q6  58.68,26.29 270 top
Q7  52.33,26.29 270 top
R2  322.21,9.14 90 top
R5  269.5,9.14 90 top
R6  218.07,9.14 90 top
R7  165.36,9.14 90 top
R11  111.39,9.14 90 top
R12  58.68,11.05 90 top
R13  56.78,16.76 180 top
R15  56.78,19.3 180 top
S1  16.14,28.19 0 top
S2  369.2,4.19 0 top
U1  355.23,9.14 0 top
U2  303.16,9.14 0 top
U3  250.45,9.14 0 top
U4  197.75,9.14 0 top
U5  143.77,9.14 0 top
U6  91.07,9.14 0 top
U7  28.2,30.1 0 top
U$1  77.35,28.07 270 bottom
U$2  90.05,28.07 270 bottom
U$3  64.65,28.07 270 bottom
U$4  102.75,28.07 270 bottom
U$5  115.45,28.07 270 bottom
U$6  128.15,28.07 270 bottom
U$7  140.85,28.07 270 bottom
U$8  153.55,28.07 270 bottom
U$9  166.25,28.07 270 bottom
U$10  178.95,28.07 270 bottom
U$11  191.65,28.07 270 bottom
U$12  204.35,28.07 270 bottom
U$13  217.05,28.07 270 bottom
U$14  62.11,33.15 0 bottom
U$15  46.87,33.15 0 bottom
U$16  371.99,22.99 90 bottom
U$17  31.63,33.15 0 bottom
U$18  229.75,28.07 270 bottom
U$19  242.45,28.07 270 bottom
U$20  255.15,28.07 270 bottom
U$21  267.85,28.07 270 bottom
U$22  280.55,28.07 270 bottom
U$23  293.25,28.07 270 bottom
U$24  305.95,28.07 270 bottom
U$25  318.65,28.07 270 bottom
U$26  331.35,28.07 270 bottom
U$27  344.05,28.07 270 bottom
U$28  356.75,28.07 270 bottom
U$29  369.45,28.07 270 bottom
U$30  64.65,5.21 90 bottom
U$31  39.63,19.94 0 top
U$34  338.72,33.27 270 top
U$35  237.75,33.27 270 top
U$36  113.29,33.27 270 top
U$37  190.13,33.27 270 top
U$38  23.12,10.41 90 top
U$39  39.63,18.03 0 top
U$40  39.63,16.13 0 top
U$59  16.42,33.15 0 bottom
U$60  3.72,33.15 0 top
U$61  1.18,33.12 0 top
U$68  362.98,21.11 270 bottom
U$69  362.98,25.27 270 bottom
U$70  350.28,21.18 270 bottom
U$71  350.28,25.35 270 bottom
U$72  337.58,21.26 270 bottom
U$73  337.58,25.43 270 bottom
U$74  324.88,21.34 270 bottom
U$75  324.88,25.5 270 bottom
U$76  312.18,21.41 270 bottom
U$77  312.18,25.58 270 bottom
U$78  299.48,21.49 270 bottom
U$79  299.48,25.65 270 bottom
U$80  286.78,21.56 270 bottom
U$81  286.78,25.73 270 bottom
U$82  274.08,21.01 270 bottom
U$83  274.08,25.17 270 bottom
U$84  261.38,21.08 270 bottom
U$85  261.38,25.25 270 bottom
U$86  248.68,21.16 270 bottom
U$87  248.68,25.32 270 bottom
U$88  235.98,21.23 270 bottom
U$89  235.98,25.4 270 bottom
U$90  223.28,21.31 270 bottom
U$91  223.28,25.48 270 bottom
U$92  210.58,21.39 270 bottom
U$93  210.58,25.55 270 bottom
U$94  197.88,21.46 270 bottom
U$95  197.88,25.63 270 bottom
U$96  185.18,21.54 270 bottom
U$97  185.18,25.7 270 bottom
U$98  172.48,21.62 270 bottom
U$99  172.48,25.78 270 bottom
U$100  159.78,21.56 270 bottom
U$101  159.78,25.73 270 bottom
U$102  147.71,21.13 270 bottom
U$103  147.71,25.3 270 bottom
U$104  134.38,21.21 270 bottom
U$105  134.38,25.37 270 bottom
U$106  122.31,21.29 270 bottom
U$107  122.31,25.45 270 bottom
U$108  109.61,21.36 270 bottom
U$109  109.61,25.53 270 bottom
U$110  96.91,20.8 270 bottom
U$111  96.91,24.97 270 bottom
U$112  84.21,21.51 270 bottom
U$113  84.21,25.68 270 bottom
U$114  70.88,20.96 270 bottom
U$115  70.88,25.12 270 bottom

### Tracks (layer width: path | path; a pad name or v marks a point on that pad's centre or on a via)
1_CATHODE
  Top 0.305: U$36.P$9 103.03,31.9 102.22,31.9 101.68,31.37 93.61,31.37 90.43,28.19 75.05,28.19 U$115.2
2_CATHODE
  Top 0.305: U$113.2 91.36,26.58 92.97,28.19 103.13,28.19 106.94,32 U$36.P$8
3.3V  (via drill 0.33)
  Top 0.203: 51.37,6.04 53.4,4.01 53.4,3.61 53.81,3.2 58.28,3.2 59.7,4.62 J3.2 | 51.37,6.04 39.79,17.63 39.79,18.03 U$39.1 | 81.04,22.41 81.04,20.27 82.05,19.25 82.05,12.95 U6.16 | U2.16 294.19,12.95 294.19,15.19 290.53,18.85 290.53,20.47 290.46,20.57 | v156.02,11.74 156.02,8.69 C5.1 | C3.1 262.7,8.08 262.7,20.07 U$84.3 | 315.33,20.51 315.33,8.08 C2.1 | C1.1 367.75,13.16 367.75,18.64 366.33,20.07 366.29,20.21 | 51.37,6.04 60.72,15.39 61.12,15.39 63.36,17.63 63.36,18.85 66.2,21.69 66.3,21.84 | v111.72,14.17 111.72,20.27 U$108.3
  Top 0.305: U$69.3 364.99,24.38 366.66,24.38 366.66,20.57 366.29,20.21 U$68.3 364.49,20.21 362.69,22.01 U$68.1 360.81,21.84 357.13,21.84 | 357.13,21.84 355.23,19.94 352.62,19.94 U$70.3 351.07,20.28 349.27,22.08 U$70.1 345.31,22.08 | 357.13,21.84 354.59,24.38 352.34,24.38 U$71.3 | 345.31,22.08 343.58,20.36 U$72.3 338.3,20.36 336.5,22.16 U$72.1 331.73,22.16 | 345.31,22.08 344.83,22.08 342.39,24.53 U$73.3 | 331.73,22.16 331.41,22.16 329.69,20.44 U$74.3 325.52,20.44 323.72,22.24 U$74.1 318.79,22.24 | 331.73,22.16 329.29,24.6 U$75.3 | 318.79,22.24 317.07,20.51 315.33,20.51 U$76.3 312.75,20.51 310.95,22.31 U$76.1 305.7,22.31 | 318.79,22.24 318.64,22.24 316.2,24.68 U$77.3 | 305.7,22.31 305.53,22.31 303.79,20.57 301.49,20.57 U$78.3 299.97,20.59 298.17,22.39 U$78.1 292.27,22.39 | 305.7,22.31 303.26,24.75 U$79.3 | 292.27,22.39 290.46,20.57 288.87,20.57 U$80.3 287.83,20.66 286.01,22.48 284.79,22.48 U$80.1 280.31,22.46 | 292.27,22.39 291.09,23.57 291.09,24.38 290.65,24.83 U$81.3 | U$83.3 278.51,24.27 280.31,22.46 | 280.31,22.46 277.95,20.11 U$82.3 275.69,20.11 273.89,21.91 U$82.1 268.3,21.91 | 268.3,21.91 266.57,20.18 U$84.3 262.28,20.18 260.48,21.98 U$84.1 | 268.3,21.91 267.54,21.91 265.06,24.38 263.41,24.38 U$85.3 | 255.04,21.98 254.76,21.98 252.32,24.42 U$87.3 | U$89.3 239.54,24.5 241.98,22.06 | 229.5,21.84 228.86,21.84 226.13,24.58 U$91.3 | 217.8,22.21 217.07,22.21 214.63,24.65 U$93.3
  Top 0.381: 204.54,22.29 204.73,22.29 202.29,24.73 U$95.3 | 191.92,22.36 191.51,22.36 188.86,25.02 187.39,25.02 U$97.3 | 179.29,22.44 178.74,22.44 176.16,25.02 174.61,25.02 U$99.3 | U$98.1 170.44,22.48 | 166,22.48 165.36,22.48 163.01,24.83 U$101.3 | U$100.3 161.68,20.57 160.92,20.57 | U$100.1 157.76,22.48 | U$103.3 152.65,24.4 154.57,22.48 | U$102.3 149.42,19.94 | 146.95,21.84 146.76,22.03 | U$102.1 145.52,21.84 | 139.96,21.84 138.69,23.11 138.69,23.75 137.97,24.48 U$105.3 | 128.8,22.11 128.27,22.11 125.83,24.55 U$107.3 | 120.57,22.18 U$106.1 | 111.72,20.57 U$108.3 | 116.17,22.18 116.13,22.18 113.69,24.63 U$109.3 | 99.58,20.07 99.42,19.9 U$110.3 | 102.92,22.26 102.72,22.26 100.91,24.07 U$111.3 | U$110.1 94.53,22.08 | 90.04,22.08 90.12,22.16 87.5,24.78 U$113.3 | 77.67,22.41 76.53,22.41 74.72,24.22 U$115.3
  Top 0.508: U$84.1 255.04,21.98 253.31,20.26 U$86.3 249.5,20.26 247.7,22.06 U$86.1 243.05,22.06 | 243.05,22.06 241.32,20.33 U$88.3 236.72,20.33 234.92,22.13 U$88.1 229.79,22.13 229.5,21.84 228.07,20.41 U$90.3 223.95,20.41 222.15,22.21 U$90.1 217.8,22.21 216.08,20.49 U$92.3 | 243.05,22.06 241.98,22.06 | U$114.1 | 34.05,29.97 33.92,30.1 | C8.+ 42.94,30.1
  Top 0.61: U$92.3 210.38,20.49 U$92.1 204.73,22.29 | 204.54,22.29 202.82,20.56 U$94.3 198.08,22.36 U$94.1 191.92,22.36 190.19,20.64 U$96.3 184.98,20.64 U$96.1 179.29,22.44 177.57,20.71 U$98.3 172.28,20.71 U$98.1 | U$100.3 164.18,20.66 166,22.48 170.44,22.48 | U$100.1 159.03,22.46 160.92,20.57 | 157.76,22.48 154.57,22.48 153.93,22.48 151.69,20.23 U$102.3 | 149.42,19.94 148.22,19.94 146.95,21.21 146.95,21.84 | 146.76,22.03 U$102.1 | 145.52,21.84 139.96,21.84 138.43,20.31 U$104.3 135.15,20.31 133.35,22.11 U$104.1 128.8,22.11 127.07,20.39 U$106.3 122.37,20.39 120.57,22.18 | U$106.1 116.17,22.18 114.56,20.57 111.72,20.57 | U$108.3 109.41,20.46 U$108.1 102.92,22.26 100.72,20.07 99.58,20.07 | U$110.3 96.71,19.9 U$110.1 | 94.53,22.08 90.04,22.08 | 33.92,30.1 U7.OUT | U$114.1 70.1,21.86 71.9,20.05 U$114.3 75.31,20.05 77.67,22.41 81.04,22.41 U$112.1 83.51,22.41 85.31,20.61 U$112.3 88.57,20.61 89.66,21.7 90.12,22.16 | C8.+ 34.05,29.97 | 42.94,30.1 60.59,30.1 65.67,25.02 65.67,22.48 66.3,21.84 U$114.1
  Bottom 0.203: U5.16 126.15,12.95 124.72,11.53 111.72,11.53 | 111.72,11.53 106.03,11.53 C6.1 | U4.16 188.73,12.95 188.73,16.82 183.25,22.3 U$96.1 | U3.16 241.56,16.82 238.11,20.27 U$88.3 | U1.16 346.21,12.95 346.21,13.77 339.71,20.27 U$72.3 | v156.02,11.74 161.71,17.42 161.71,20.55 U$100.3 | C4.1 209.86,8.69 209.86,12.95 212.51,15.6 212.51,20.47 U$92.3 | v111.72,14.17 111.72,11.53
3_CATHODE
  Top 0.305: U$111.2 99.97,26.92 103.77,26.92 106.94,30.1 108.21,30.1 109.48,31.37 U$36.P$7
4_CATHODE
  Top 0.305: U$109.2 111.61,32.86 U$36.P$6
5_CATHODE
  Top 0.305: U$107.2 121.83,28.83 119.01,28.83 117.1,30.73 117.1,31.37 115.2,33.27 U$36.P$5
5V
  Top 0.203: C7.1 24.34,24.94 30.85,24.94 39.58,16.2 U$40.1 | 14.84,22.48 JP1.1
  Top 0.305: J1.2 3.44,23.11 3.44,18.67 U$38.VIN | C7.1 23.12,26.42 23.12,28.19 25.03,30.1 U7.IN
  Top 0.508: 14.23,22.48 4.07,22.48 3.44,23.11 | 14.23,22.48 14.23,23.11 14.87,23.75 18.68,23.75 21.22,26.29 21.22,28.83 22.49,30.1 U7.IN | 14.23,22.48 14.84,22.48
6_CATHODE
  Top 0.305: U$105.2 133.85,28.8 124.03,28.8 122.74,30.1 120.28,30.1 U$36.P$4
7_CATHODE
  Top 0.305: U$103.2 146.44,29.46 141.54,29.46 141.39,29.31 127.62,29.31 127.46,29.46 124.09,29.46 122.18,31.37 120.28,31.37 119.64,32 U$36.P$3
8_CATHODE
  Top 0.305: U$101.2 155.77,32.64 126.63,32.64 125.36,31.37 123.45,31.37 122.18,32.64 U$36.P$2
9_CATHODE
  Top 0.305: U$99.2 175.99,28.19 179.97,28.19 181.24,29.46 U$37.P$9
10_CATHODE
  Top 0.305: U$97.2 185.05,28.73 185.05,30.1 183.78,31.37 U$37.P$8
11_CATHODE
  Top 0.305: U$95.2 197.75,28.66 197.75,28.83 188.86,28.83 186.32,31.37 U$37.P$7
12_CATHODE
  Top 0.305: U$93.2 210.45,28.58 210.45,28.83 199.65,28.83 197.75,30.73 194.57,30.73 193.3,32 190.13,32 U$37.P$6
13_CATHODE
  Top 0.305: U$91.2 226.46,27.56 232.04,27.56 234.58,30.1 237.12,30.1 239.02,32 U$35.P$5
14_CATHODE
  Top 0.305: U$89.2 237.98,28.42 241.56,32 U$35.P$4
15_CATHODE
  Top 0.305: U$87.2 246.64,30.26 246.64,30.73 U$35.P$3
16_CATHODE
  Top 0.305: U$85.2 261.33,28.19 254.26,28.19 251.09,31.37 247.91,31.37 246.64,32.64 U$35.P$2
17_CATHODE
  Top 0.305: U$83.2 277.76,27.75 277.76,29.64 281.39,33.27 324.75,33.27 326.02,32 328.56,32 U$34.P$9
18_CATHODE
  Top 0.305: U$81.2 290.46,28.31 290.46,31.37 291.73,32.64 324.67,32.64 325.81,31.5 328.77,31.5 329.28,32 331.73,32 332.37,32.64 U$34.P$8
19_CATHODE
  Top 0.305: U$34.P$7 334.91,32 331.61,28.7 317.55,28.7 317.05,28.19 302.52,28.19 301.48,27.15 U$79.2
20_CATHODE
  Top 0.305: U$34.P$6 337.45,32.64 334.91,30.1 334.27,30.1 332.37,28.19 317.76,28.19 316.05,26.48 U$77.2
21_CATHODE
  Top 0.305: U$75.2 331.85,26.4 334.27,28.83 338.08,28.83 338.08,31.37 U$34.P$5
22_CATHODE
  Top 0.305: U$73.2 339.58,30.32 U$34.P$4
23_CATHODE
  Top 0.305: U$71.2 346.52,32 345.7,32 345.07,32.64 U$34.P$3
24_CATHODE
  Top 0.305: U$69.2 362.32,28.83 352.05,28.83 U$34.P$2
A0  (via drill 0.33)
  Top 0.203: v87.74,7.06 99.53,7.06 105.01,12.55 123.71,12.55 124.52,13.36 | 124.52,13.36 125.33,14.17 136.1,14.17 137.32,12.95 U5.15 | U4.15 190.56,12.95 189.14,11.53 v176.34,11.53 | v127.37,7.87 126.15,7.87 125.33,8.69 125.33,12.55 124.52,13.36
  Bottom 0.203: v87.74,7.06 84.9,9.91 84.9,12.95 U6.15 84.69,12.95 74.53,23.11 72.3,23.11 71.69,23.72 71.69,24.94 69.66,26.98 66.41,26.98 57.46,18.03 52.38,18.03 46.9,23.52 14.79,23.52 8.7,29.62 2.4,29.62 1.38,28.6 1.38,17.63 12.96,6.04 U$38.A0 | v176.34,11.53 163.33,11.53 159.06,7.26 150.33,7.26 148.7,5.64 148.7,4.83 148.09,4.22 142,4.22 141.39,4.83 141.39,7.87 141.59,8.08 141.59,8.48 140.98,9.09 133.46,9.09 132.24,7.87 v127.37,7.87
A1  (via drill 0.33)
  Top 0.203: U3.15 245.02,12.95 246.24,14.17 252.13,14.17 253.15,13.16 253.15,12.34 258.84,6.66 264.73,6.66 268.39,10.31 270.62,10.31 270.82,10.11 270.82,8.69 271.64,7.87 291.55,7.87 296.63,12.95 U2.15 | v29.22,1.37 17.64,1.37 16.21,2.79 U$38.A1 | v48.52,3.61 48.93,3.61 49.34,3.2 52.18,3.2 v52.59,3.61 | v233.64,2.59 v231.81,0.76
  Bottom 0.203: U1.15 348.04,12.95 346.82,11.74 345.81,11.74 338.29,19.25 335.04,19.25 328.13,26.16 328.13,26.77 327.31,27.58 322.44,27.58 315.33,20.47 315.33,20.07 309.43,14.17 306.59,14.17 305.57,13.16 305.57,12.34 304.56,11.33 298.46,11.33 296.83,12.95 U2.15 | v29.22,1.37 46.29,1.37 v48.52,3.61 | v52.59,3.61 53.4,3.61 56.25,0.76 v231.81,0.76 | v233.64,2.59 244,12.95 U3.15
A4  (via drill 0.33)
  Top 0.203: v54.21,6.66 54.82,6.66 55.43,7.26 72.5,7.26 74.94,4.83 J4.2
  Bottom 0.203: U$38.A4 23.73,2.79 25.97,0.56 48.12,0.56 v54.21,6.66
D7  (via drill 0.33)
  Top 0.203: v45.88,21.08 51.17,21.08 52.79,19.46 R15.P$2
  Bottom 0.203: Q7.1 52.18,28.8 50.35,26.98 50.35,21.89 52.79,19.46 R15.P$2 | U$38.D7 23.73,18.03 26.78,21.08 v45.88,21.08
D9  (via drill 0.33)
  Top 0.203: Q6.1 58.68,28.8 60.51,26.98 60.51,23.11 54.21,16.82 52.99,16.82 R13.P$2 52.79,16.82 51.37,18.24 v49.74,18.24
  Bottom 0.203: U$38.D9 21.29,18.03 25.16,21.89 46.09,21.89 v49.74,18.24
D11  (via drill 0.33)
  Top 0.203: v55.64,6.45 68.44,6.45 70.06,4.83 J4.1
  Bottom 0.203: U$38.D11 16.21,18.03 20.48,22.3 46.69,22.3 50.56,18.44 50.56,11.53 v55.64,6.45
GND
  Top 0.203: 11.69,30.1 14.23,30.1 S1.P1 | R13.P$1 60.51,16.82 60.51,19.25 R15.P$1 | 39.58,23.75 39.58,20.07 U$31.1
  Top 0.305: C7.2 28.2,28.7 U7.GND | U1.8 364.12,7.11 366.66,9.65 367.29,9.65 C1.2 | U2.8 315.1,5.33 C2.2 | U3.8 262.39,5.33 C3.2 266.84,5.21 269.5,7.87 R5.P$1 | U4.8 209.31,5.33 C4.2 214.13,5.84 217.43,9.14 R6.P$1 | U6.8 100.47,5.84 C6.2 103.26,5.97 108.21,5.97 R11.P$1 | U5.8 153.17,5.84 C5.2 156.6,6.6 162.82,6.6 R7.P$1
  Top 0.508: U7.GND 27.57,30.73 27.57,32 24.39,32 23.76,31.37 20.58,31.37 19.31,30.1 18.04,30.1 | J1.1 5.34,30.1 11.69,30.1 18.04,30.1 | S1.P1 18.04,30.1
  Top 0.61: Q6.3 Q7.3 44.08,23.75 | 44.08,23.75 39.58,23.75 34.55,23.75 U7.GND | C8.- 42.81,25.02 44.08,23.75
  Bottom 0.203: C1.2 367.93,2.79 366.66,1.52 324.11,1.52 | R2.P$1 322.21,3.43 324.11,1.52 | 324.11,1.52 312.68,1.52 | 312.68,1.52 312.05,2.16 U2.8 | 312.68,1.52 263.15,1.52 | 263.15,1.52 262.52,2.16 C3.2 | 263.15,1.52 211.72,1.52 | 211.72,1.52 209.81,3.43 C4.2 | 211.72,1.52 157.11,1.52 | C5.2 155.84,2.79 157.11,1.52 | 58.68,6.66 R12.P$1 56.82,12.92 | 157.11,1.52 136.1,1.52 | 136.1,1.52 65.27,1.52 65.17,1.42 63.23,1.42 61.35,3.3 61.35,6.48 61.17,6.66 58.68,6.66 | 5.34,23.11 46.62,23.11 51.06,18.67 51.06,14.86 54.87,14.86 56.82,12.92 | 58.68,6.66 56.85,6.66 55.03,4.83 J3.1 | 56.82,12.92 60.51,16.61 R13.P$1 | 136.1,1.52 136.1,5.84 135.49,6.45 114.97,6.45 112.33,9.09 111.52,9.09 R11.P$1
  Bottom 0.508: U$38.GND 5.34,23.11 5.34,26.29 J1.1 | C1.2 367.93,5.33 369.07,4.19 S2.P1
LOAD
  Top 0.203: 186.95,3.43 135.52,3.43 134.88,4.06 U5.1 | 186.95,3.43 U4.1 | 186.95,3.43 239.66,3.43 | 239.66,3.43 U3.1 | 239.66,3.43 292.36,3.43 | 292.36,3.43 U2.1 | 292.36,3.43 344.43,3.43 U1.1 | 39,2.79 61.86,2.79 63.13,4.06 66.94,4.06 68.21,2.79 79.64,2.79 U6.1
  Top 0.254: U$38.2 39,2.79
  Bottom 0.203: U5.1 132.34,2.79 82.81,2.79 82.18,3.43 U6.1
MISO
  Top 0.203: U$38.MISO 34.55,1.52 64.04,1.52 64.14,1.42 80.81,1.42 83.45,4.06 83.45,6.6 84.72,7.87 88.53,7.87 90.43,9.78 98.69,9.78 99.96,11.05 U6.9 123.45,12.95 125.99,15.49 258.07,15.49 259.34,14.22 U3.9
N$1
  Top 0.305: U$94.2 198.49,23.75 198.38,23.75 197.75,24.38 197.75,25.65 196.87,26.53 U$95.1
N$2
  Top 0.305: U$92.2 211.11,23.75 210.45,23.75 209.81,24.38 209.81,25.65 209.02,26.45 U$93.1
N$3
  Top 0.305: U$96.2 185.87,23.75 185.68,23.75 185.05,24.38 185.05,25.02 183.46,26.61 U$97.1
N$4
  Top 0.305: U$98.2 174.22,22.52 172.35,24.38 172.35,25.65 171.32,26.68 U$99.1
N$5
  Top 0.305: U$106.2 123.75,22.18 122.18,23.75 122.18,25.02 120.85,26.35 U$107.1
N$6
  Top 0.305: U$104.2 135.25,22.11 134.25,23.11 134.25,25.02 132.99,26.28 U$105.1
N$7
  Top 0.305: U$100.2 161.57,22.46 159.65,24.38 159.65,25.02 158.04,26.63 U$101.1
N$8
  Top 0.305: U$108.2 110.97,22.26 109.48,23.75 109.48,25.02 108.08,26.43 U$109.1
N$10
  Top 0.305: U$102.2 149.3,22.03 148.22,23.11 148.22,24.38 146.4,26.2 U$103.1
N$11
  Top 0.305: U$110.2 98.19,21.7 96.78,23.11 96.78,25.02 95.93,25.87 U$111.1
N$12  (via drill 0.33)
  Top 0.203: v309.03,14.99 309.03,14.17 308.21,13.36 308.21,6.66 306.99,5.44 U2.6
  Bottom 0.203: v309.03,14.99 309.03,22.91 310.04,23.93 310.04,24.54 U$77.4 | R5.P$9 289.93,9.09 295.01,9.09 296.83,7.26 301.71,7.26 303.13,5.84 303.13,5.03 303.95,4.22 305.77,4.22 306.79,5.23 U2.6
N$13
  Top 0.305: U$112.2 84.88,23.75 84.72,23.75 84.08,24.38 84.08,25.65 83.16,26.58 U$113.1
N$14
  Top 0.305: U$114.2 71.62,23.11 71.38,23.11 70.75,23.75 70.75,25.02 69.75,26.02 U$115.1
N$15
  Top 0.203: U3.11 254.16,12.95 252.54,14.58 228.56,14.58 223.28,9.3 R6.P$3
  Bottom 0.203: U$90.4 221.45,20.27 221.45,10.92 223.07,9.3 R6.P$3
N$16
  Top 0.203: U3.12 250.91,12.95 248.27,10.31 230.18,10.31 229.37,9.5 229.37,8.48 228.76,7.87 221.85,7.87 220.63,9.09 R6.P$2
  Bottom 0.203: U$91.4 221.24,24.54 221.24,23.93 220.02,22.71 220.02,9.7 220.43,9.3 R6.P$2
N$17
  Bottom 0.203: R6.P$4 225.71,9.3 233.84,17.42 233.84,20.27 U$88.4 234.05,20.47 236.89,23.32 247.05,23.32 249.08,21.29 249.08,12.95 U3.13
N$18
  Bottom 0.203: U$110.4 94.85,19.84 94.85,19.66 88.55,13.36 88.55,6.66 87.33,5.44 U6.3 87.13,5.44 85.71,6.86 76.36,6.86 72.3,10.92 71.49,10.92 R12.P$6
N$19
  Top 0.203: U3.14 245.83,12.95 243.6,10.72 229.78,10.72 228.36,9.3 R6.P$5
  Bottom 0.203: U$89.4 233.84,24.33 233.84,23.93 224.49,14.58 224.49,8.69 225.31,7.87 226.93,7.87 228.15,9.09 R6.P$5
N$20
  Top 0.203: R6.P$8 235.87,9.09 236.69,9.09 237.91,7.87 249.29,7.87 251.72,5.44 U3.5
  Bottom 0.203: U$84.4 259.24,20.07 259.24,17.02 255.38,13.16 255.38,4.83 254.77,4.22 252.74,4.22 251.72,5.23 U3.5
N$21
  Bottom 0.508: U$34.P$1 346.08,29.21 328.18,29.21 324.11,33.27 U$35.P$1 243.85,27.94 66.05,27.94 64.4,26.29
  Bottom 0.61: 64.4,26.29 Q6.2
N$22
  Top 0.203: U3.6 250.5,9.09 238.52,9.09 R6.P$9
  Bottom 0.203: U3.6 253.15,6.45 253.15,17.83 259.24,23.93 259.24,24.33 U$85.4
N$23
  Top 0.203: R6.P$6 230.79,9.09 231.61,9.09 233.64,7.06 245.02,7.06 246.64,5.44 U3.3
  Bottom 0.203: U$86.4 246.85,20.07 246.85,14.38 247.86,13.36 247.86,6.66 246.64,5.44 U3.3
N$24
  Top 0.203: U3.4 247.05,7.47 235.87,7.47 234.25,9.09 233.44,9.09 R6.P$7
  Bottom 0.203: U3.4 250.3,6.45 250.3,13.56 249.49,14.38 249.49,21.69 246.85,24.33 U$87.4
N$25
  Top 0.203: U$80.4 284.64,20.47 284.64,16.82 277.12,9.3 R5.P$4
  Bottom 0.203: U2.13 301.1,12.95 298.26,15.8 289.52,15.8 284.85,20.47 U$80.4
N$26  (via drill 0.33)
  Top 0.203: v289.11,18.64 279.77,9.3 R5.P$5
  Bottom 0.203: U$81.4 284.85,24.74 284.85,24.13 287.69,21.29 287.69,20.07 v289.11,18.64 291.55,16.2 300.29,16.2 303.13,13.36 303.13,12.55 302.32,11.74 300.69,11.74 299.48,12.95 U2.14
N$27
  Top 0.203: U$76.4 310.04,20.47 310.04,17.63 305.57,13.16 305.57,6.45 304.56,5.44 U2.5
  Bottom 0.203: R5.P$8 287.28,9.3 288.3,9.3 289.32,10.31 294.4,10.31 297.04,7.67 302.12,7.67 304.35,5.44 U2.5
N$29
  Top 0.203: U$78.4 297.65,20.47 297.65,13.77 298.05,13.36 298.05,6.66 299.27,5.44 U2.3
  Bottom 0.203: R5.P$6 282.2,9.09 283.02,9.09 285.66,6.45 298.26,6.45 299.27,5.44 U2.3
N$30
  Top 0.203: 64.17,11.53 63.76,11.12 R12.P$3 64.17,11.53 | 64.17,11.53 68.84,16.2 68.84,19.86 U$114.4 | U6.11 94.04,12.95 92.82,14.17 91.81,14.17 90.99,13.36 90.99,12.55 87.13,8.69 67.01,8.69 64.17,11.53
N$32  (via drill 0.33)
  Top 0.203: v298.66,17.42 298.66,15.39 300.69,13.36 300.69,6.45 301.71,5.44 U2.4
  Bottom 0.203: v298.66,17.42 298.66,22.91 297.65,23.93 297.65,24.74 U$79.4 | R5.P$7 284.85,9.09 285.66,9.09 287.89,6.86 300.29,6.86 301.71,5.44 U2.4
N$33  (via drill 0.33)
  Top 0.203: v274.48,18.85 274.48,9.3 R5.P$3
  Bottom 0.203: 274.08,21.69 274.48,21.29 v274.48,18.85 | 274.08,21.69 272.25,23.52 272.25,24.13 U$83.4 | 274.08,21.69 275.5,23.11 276.51,23.11 280.98,27.58 285.45,27.58 285.86,27.18 285.86,26.16 288.3,23.72 289.32,23.72 296.43,16.61 300.69,16.61 304.35,12.95 U2.12
N$34
  Top 0.203: R7.P$4 173.09,9.3 173.09,9.91 177.76,14.58 194.83,14.58 196.45,12.95 U4.13
  Bottom 0.203: U$96.4 183.25,20.47 183.25,16.82 188.33,11.74 195.23,11.74 196.45,12.95 U4.13
N$35
  Top 0.203: R5.P$2 272.04,20.07 U$82.4
  Bottom 0.203: U2.11 306.79,12.95 304.76,10.92 297.24,10.92 295.41,12.75 295.41,13.56 293.58,15.39 276.92,15.39 272.25,20.07 U$82.4
N$36
  Top 0.203: 335.65,14.58 335.65,10.92 337.27,9.3 R2.P$7 | 335.65,14.58 335.65,20.27 U$72.4 | 335.65,14.58 352.31,14.58 353.93,12.95 U1.13
N$37
  Top 0.203: R2.P$6 335.04,9.09 336.66,7.47 343.98,7.47 348.24,11.74 350.07,11.74 351.29,12.95 U1.14
  Bottom 0.203: U$73.4 335.65,24.33 338.08,24.33 339.1,23.32 340.93,23.32 351.29,12.95 U1.14
N$38
  Top 0.203: U$68.4 360.84,20.07 360.84,16.41 357.79,13.36 357.79,6.66 356.57,5.44 U1.5
  Bottom 0.203: R2.P$5 332.39,9.09 333.21,9.09 338.08,4.22 355.36,4.22 356.37,5.23 U1.5
N$39
  Bottom 0.203: U$69.4 361.05,24.33 361.05,23.72 363.89,20.88 363.89,15.39 365.72,13.56 365.72,11.94 359.22,5.44 U1.6 359.01,5.23 357.59,3.81 336.05,3.81 330.77,9.09 329.96,9.09 R2.P$4
N$40
  Top 0.203: R2.P$2 324.88,9.09 325.69,9.09 328.13,6.66 344.38,6.66 344.79,7.06 349.67,7.06 351.29,5.44 U1.3
  Bottom 0.203: U$70.4 348.45,20.27 350.68,20.27 356.37,14.58 364.09,14.58 365.31,13.36 365.31,12.14 359.62,6.45 352.51,6.45 351.49,5.44 U1.3
N$41  (via drill 0.33)
  Top 0.203: 353.73,7.47 353.73,5.64 353.93,5.44 U1.4 | 353.73,7.47 v353.73,10.52 | 353.73,7.47 344.59,7.47 344.18,7.06 330.16,7.06 328.13,9.09 327.31,9.09 R2.P$3
  Bottom 0.203: v353.73,10.52 355.76,10.52 357.79,12.55 357.79,13.36 356.98,14.17 352.71,14.17 347.02,19.86 347.02,22.5 348.24,23.72 348.24,24.33 U$71.4
N$42  (via drill 0.33)
  Top 0.203: v343.57,12.95 343.57,12.75 340.12,9.3 R2.P$8
  Bottom 0.203: 343.77,13.16 345.6,11.33 354.75,11.33 356.37,12.95 U1.12 | 343.77,13.16 340.93,16 337.68,16 330.36,23.32 326.5,23.32 325.28,24.54 323.05,24.54 U$75.4 | 343.77,13.16 v343.57,12.95
N$43
  Top 0.203: U$74.4 323.05,20.27 324.88,20.27 334.83,10.31 335.44,10.31 336.25,9.5 336.25,8.69 337.07,7.87 341.13,7.87 342.35,9.09 R2.P$9 342.55,9.3 342.55,10.92 345.81,14.17 351.9,14.17 352.71,13.36 352.71,12.55 355.15,10.11 355.15,5.03 355.97,4.22 356.98,4.22 357.79,5.03 357.79,5.84 359.01,7.06 359.01,12.95 U1.11
N$45
  Top 0.305: U$68.2 362.85,24.13 362.85,25.02 361.69,26.17 U$69.1
N$46
  Top 0.305: U$70.2 350.15,24.21 350.15,25.02 348.92,26.25 U$71.1
N$47
  Top 0.305: U$72.2 337.99,23.75 337.45,23.75 337.45,25.65 336.78,26.32 U$73.1
N$48
  Top 0.305: U$74.2 326,23.11 325.38,23.11 324.75,23.75 324.75,25.65 324,26.4 U$75.1
N$49
  Top 0.305: U$82.2 274.87,23.11 274.58,23.11 273.95,23.75 273.95,25.02 272.9,26.07 U$83.1
N$50
  Top 0.305: U$80.2 287.49,23.75 286.65,23.75 286.65,25.65 285.67,26.63 U$81.1
N$51
  Top 0.305: U$76.2 313.37,23.11 312.68,23.11 312.05,23.75 312.05,25.02 310.59,26.48 U$77.1
N$52
  Top 0.305: U$78.2 300.75,23.11 299.98,23.11 299.35,23.75 299.35,25.02 297.81,26.55 U$79.1
N$53
  Top 0.305: U$84.2 262.88,22.48 261.88,22.48 261.25,23.11 261.25,25.65 260.75,26.15 U$85.1
N$54
  Top 0.305: U$86.2 249.62,23.11 249.18,23.11 248.55,23.75 248.55,25.65 247.98,26.22 U$87.1
N$55
  Top 0.305: U$88.2 237,23.11 236.48,23.11 235.85,23.75 235.85,25.65 235.2,26.3 U$89.1
N$56
  Top 0.305: U$90.2 223.74,23.75 223.15,23.75 223.15,25.65 222.43,26.38 U$91.1
N$58  (via drill 0.33)
  Top 0.203: v86.12,15.8 86.12,12.75 83.27,9.91 75.96,9.91 74.94,10.92 73.92,10.92 R12.P$7
  Bottom 0.203: U6.4 89.98,5.44 90.99,6.45 90.99,13.36 96.07,18.44 96.07,22.91 95.06,23.93 U$111.4 94.85,23.93 94.24,23.93 v86.12,15.8
N$62  (via drill 0.33)
  Top 0.203: v203.77,14.38 202.75,13.36 202.75,9.09 199.09,5.44 U4.5
  Bottom 0.203: v203.77,14.38 208.44,19.05 208.44,20.47 U$92.4 | R7.P$8 183.25,9.09 188.12,4.22 197.88,4.22 198.89,5.23 U4.5
N$63
  Bottom 0.508: U$37.P$1 200.85,33.27 196.79,29.21 178.37,29.21 174.31,33.27 U$36.P$1 120.28,28.83 63.13,28.83 60.59,31.37 56.78,31.37 55.51,30.1 55.51,26.92 54.87,26.29 Q7.2
N$65  (via drill 0.33)
  Top 0.203: v198.49,9.91 194.01,5.44 U4.3
  Bottom 0.203: v198.49,9.91 200.11,9.91 202.75,12.55 202.75,13.36 196.05,20.07 196.05,20.47 U$94.4 | R7.P$6 178.17,9.3 178.98,9.3 179.99,10.31 183.65,10.31 184.46,9.5 184.46,8.69 186.7,6.45 192.8,6.45 193.81,5.44 U4.3
N$68  (via drill 0.33)
  Top 0.203: R7.P$2 168.01,9.3 170.44,11.74 v170.44,14.38 171.05,14.99 199.5,14.99 201.53,12.95 U4.11
  Bottom 0.203: v170.44,14.38 170.44,20.68 U$98.4
N$74  (via drill 0.33)
  Top 0.203: v154.59,13.36 154.59,12.55 153.37,11.33 150.12,11.33 148.7,12.75 148.7,13.56 148.09,14.17 146.26,14.17 U5.12
  Bottom 0.203: v154.59,13.36 154.59,14.17 152.56,16.2 148.09,16.2 136.92,27.38 131.84,27.38 127.77,23.32 123.91,23.32 122.69,24.54 120.46,24.54 U$107.4 | U5.12 142.81,10.72 118.83,10.72 117.41,9.3 116.6,9.3 R11.P$3
N$87
  Top 0.203: U6.12 92.21,12.95 87.54,8.28 63.97,8.28 61.33,10.92 R12.P$2
  Bottom 0.203: U$115.4 68.84,24.13 61.93,17.22 61.93,11.74 61.33,11.12 R12.P$2
N$89  (via drill 0.33)
  Top 0.203: v151.95,14.78 150.53,14.78 150.33,14.99 144.64,14.99 142.61,12.95 U5.13 142.4,12.95 141.18,14.17 139.56,14.17 138.74,13.36 138.74,12.55 137.93,11.74 132.65,11.74 130.82,9.91 v130.41,9.91
  Bottom 0.203: v151.95,14.78 151.34,15.39 139.76,15.39 134.88,20.27 132.45,20.27 U$104.4 | v130.41,9.91 130.01,10.31 121.07,10.31 120.05,9.3 119.03,9.3 R11.P$4
N$91  (via drill 0.33)
  Top 0.203: v155.41,14.17 155.41,12.75 149.92,7.26 146.26,7.26 145.04,6.04 | U5.5 145.04,6.04 | 145.04,6.04 144.64,6.45 141.59,6.45 140.17,7.87 131.23,7.87 130.01,9.09 129.19,9.09 R11.P$8
  Bottom 0.203: v155.41,14.17 157.64,16.41 157.64,20.55 U$100.4
N$93  (via drill 0.33)
  Top 0.203: v121.88,13.77 122.29,13.36 123.1,13.36 125.74,16 135.52,16 139.58,20.07 145.65,20.07 U$102.4 | v124.52,12.34 124.52,9.7 124.11,9.3 R11.P$6 124.11,9.09 126.15,7.06 137.32,7.06 138.95,5.44 139.96,5.44 U5.3
  Bottom 0.203: v121.88,13.77 122.29,13.77 123.71,12.34 v124.52,12.34
N$97  (via drill 0.33)
  Top 0.203: v122.89,14.17 120.46,16.61 120.46,20.27 U$106.4 | v140.78,8.28 142.81,8.28 147.48,12.95 U5.11
  Bottom 0.203: v122.89,14.17 146.26,14.17 147.48,12.95 U5.11 | v140.78,8.28 139.56,7.06 115.99,7.06 113.95,9.09 R11.P$2
N$101
  Top 0.203: 89.77,12.95 89.77,14.17 83.47,20.47 82.25,20.47 U$112.4 | 89.77,12.95 85.91,9.09 69.05,9.09 67.22,10.92 66.41,10.92 R12.P$4 | 89.77,12.95 U6.13
N$102
  Top 0.203: R12.P$5 68.84,10.92 69.86,10.92 71.28,9.5 83.68,9.5 87.13,12.95 U6.14
  Bottom 0.203: U$113.4 82.25,24.74 82.25,24.13 84.69,21.69 84.69,15.39 87.13,12.95 U6.14
N$105  (via drill 0.33)
  Top 0.203: v153.78,13.97 153.78,12.34 153.17,11.74 152.16,11.74 151.34,12.55 151.34,13.36 150.12,14.58 145.04,14.58 143.62,13.16 143.62,12.34 143.01,11.74 141.18,11.74 U5.14
  Bottom 0.203: v153.78,13.97 151.95,15.8 147.89,15.8 140.37,23.32 135.9,23.32 134.88,24.33 132.45,24.33 U$105.4 | U5.14 138.13,11.12 116.8,11.12 115.17,9.5 115.17,8.69 115.99,7.87 119.44,7.87 120.66,9.09 121.47,9.09 R11.P$5
N$108  (via drill 0.33)
  Top 0.203: v95.67,10.52 96.68,10.52 98.71,12.55 98.71,13.36 99.53,14.17 100.95,14.17 107.05,20.27 107.45,20.27 U$108.4
  Bottom 0.203: v95.67,10.52 95.67,8.69 92.41,5.44 U6.5 92.21,5.23 91.2,4.22 86.73,4.22 86.12,4.83 86.12,5.64 85.3,6.45 74.33,6.45 70.06,10.72 70.06,11.53 70.88,12.34 74.33,12.34 75.55,11.12 76.36,11.12 R12.P$8
N$109  (via drill 0.33)
  Top 0.203: v85.51,17.42 83.47,15.39 83.47,12.55 82.05,11.12 79,11.12 R12.P$9
  Bottom 0.203: 106.17,23.25 97.09,14.17 96.89,14.17 96.28,13.56 96.28,10.92 96.48,10.72 96.48,6.86 95.06,5.44 U6.6 | 106.17,23.25 107.45,24.54 U$109.4 | v85.51,17.42 85.51,17.6 85.68,17.78 87,17.78 87.89,18.67 87.89,22.94 92.34,27.38 102.04,27.38 106.17,23.25
N$112
  Bottom 0.203: 148.7,9.5 148.7,6.45 U5.6 | 148.7,9.5 148.7,13.16 149.72,14.17 150.53,14.17 151.34,13.36 151.34,12.55 152.16,11.74 153.98,11.74 156.22,13.97 156.22,14.38 158.86,17.02 158.86,23.11 157.85,24.13 157.85,24.82 U$101.4 | 148.7,9.5 133.26,9.5 133.05,9.3 131.84,9.3 R11.P$9
N$117  (via drill 0.33)
  Top 0.203: v159.06,16.2 v156.83,18.44 | v156.22,12.95 149.72,6.45 v146.47,6.45 | R11.P$7 126.76,9.09 127.57,9.09 129.19,7.47 139.96,7.47 142,5.44 142.4,5.44 U5.4
  Bottom 0.203: v156.83,18.44 152.16,23.11 149.31,23.11 148.09,24.33 145.86,24.33 U$103.4 | v159.06,16.2 159.06,15.8 v156.22,12.95 | v146.47,6.45 143.62,6.45 U5.4
N$131
  Top 0.203: R7.P$5 175.52,11.74 177.96,14.17 192.59,14.17 193.81,12.95 U4.14
  Bottom 0.203: U4.14 193.2,12.95 186.09,20.07 186.09,21.29 183.25,24.13 183.25,24.74 U$97.4
N$135
  Bottom 0.203: U$93.4 208.65,24.54 208.65,23.93 209.66,22.91 209.66,13.36 201.74,5.44 U4.6 201.53,5.44 200.11,6.86 190.56,6.86 188.33,9.09 185.68,9.09 R7.P$9
N$140  (via drill 0.33)
  Top 0.203: U4.4 196.66,5.44 200.31,9.09 v200.31,11.12 200.31,13.36 199.5,14.17 198.49,14.17 197.88,13.56 197.88,12.75 196.25,11.12 183.45,11.12 181.62,9.3 180.6,9.3 R7.P$7
  Bottom 0.203: v200.31,11.12 200.31,13.36 194.62,19.05 194.62,22.91 195.84,24.13 195.84,24.54 U$95.4
N$141
  Top 0.203: R7.P$3 170.44,9.09 171.26,9.09 172.48,7.87 193.81,7.87 198.89,12.95 U4.12
  Bottom 0.203: U$99.4 170.65,24.74 173.09,24.74 174.1,23.72 175.73,23.72 188.12,11.33 197.27,11.33 198.89,12.95 U4.12
SCK
  Top 0.203: U1.2 347.61,6.6 345.07,6.6 342.35,3.89 298.26,3.89 U2.2 295.54,6.6 293,6.6 290.28,3.89 245.55,3.89 U3.2 242.83,6.6 240.93,6.6 238.39,4.06 192.67,4.06 U4.2 190.13,6.6 188.22,6.6 185.68,4.06 139.33,4.06 138.06,5.33 U5.2 136.15,6.6 133.61,6.6 131.07,4.06 86.62,4.06 85.35,5.33 U6.2 83.85,4.47 83.85,3.9 80.85,0.89 30.74,0.89 28.84,2.79 U$38.SCK
SCL
  Bottom 0.203: U$38.SCL 28.81,18.03 30.64,19.86 36.53,19.86 38.57,17.83 38.57,15.6 49.54,4.62 J2.2
SDA
  Bottom 0.203: U$38.SDA 31.45,18.03 32.88,19.46 36.33,19.46 38.16,17.63 38.16,11.33 44.66,4.83 J2.1
SER1
  Bottom 0.203: U6.10 99.32,14.86 150.76,14.86 U5.9
SER2
  Bottom 0.203: U5.10 152.03,11.05 162.19,11.05 164.73,13.59 184.41,13.59 188.86,9.14 202.83,9.14 U4.9
SER3
  Bottom 0.203: U3.10 258.71,14.86 290.46,14.86 296.17,9.14 308.24,9.14 U2.9
SER4
  Bottom 0.203: U2.10 310.14,12.95 312.68,15.49 339.99,15.49 345.7,9.78 362.21,9.78 364.12,11.68 U1.9
USB
  Top 0.203: JP1.2 16.01,22.5 16.16,22.48
  Top 0.508: U$38.USB 7.88,18.67 9.15,19.94 15.5,19.94 16.16,20.6 16.16,22.48

### Text on the board
tPlace: I | G | O | 22R SIP | 22R SIP | 22R SIP | 22R SIP | GND | G | Gates 13-24 | N-CH / Gates 1-12 | D | 5V | 1uF | 3.3V / REG | 560uF | S | GND | 10K | 3V | 10K | 5V | 1 | Easy Bee Counter / 12/19/19 - v0 | https://github.com/hydronics2/2019-easy-bee-counter | 100nF | 100K SIP | 100K SIP | 100K SIP | 100K SIP | 100K SIP | 100K SIP | 100nF | 100nF | 74HC165 Shift-IN | 74HC165 Shift-IN | 100nF | 74HC165 Shift-IN | 74HC165 Shift-IN | 100nF | 74HC165 Shift-IN | 100nF | 74HC165 Shift-IN | C:/Users/hydronics/Google Drive/2019/bee_counter/eagle/images/bmp_16/giant-honey-bee.bmp | 2 | 3 | 4 | 5 | 6 | 7 | 8 | 9 | 10 | 11 | 12 | 13 | 14 | 15 | 16 | 17 | 18 | 19 | 20 | 21 | 22 | 23 | 24 | GND | 3V | D11 | A4 | SDA | SCL
bPlace: GND | A | CA | AN | CA | CA | AN | CA | AN | CA | AN | CA | AN | CA | AN | CA | AN | CA | AN | CA | AN | CA | AN | CA | AN | CA | AN | CA | AN | CA | AN | CA | AN | CA | AN | CA | AN | CA | AN | CA | AN | CA | AN | CA | AN | CA | AN | CA | 5V | AN | EM | 3V | EM | 3V | EM | 3V | EM | 3V | EM | 3V | EM | 3V | EM | 3V | EM | 3V | EM | 3V | EM | 3V | EM | 3V | EM | 3V | EM | 3V | EM | 3V | EM | 3V | EM | 3V | EM | 3V | EM | 3V | EM | 3V | EM | 3V | EM | 3V | EM | 3V | EM | 3V | EM | 3V | 3V | CA | 3V | CA | 3V | CA | 3V | CA | 3V | CA | 3V | CA | 3V | CA | 3V | CA | 3V | CA | 3V | CA | 3V | CA | 3V | CA | 3V | CA | 3V | CA | 3V | CA | 3V | CA | 3V | CA | 3V | CA | 3V | CA | 3V | CA | 3V | CA | 3V | CA | 3V | CA | GND | 3V | CA | EM | EM | EM | EM | EM | 3V | EM | 3V | EM | 3V | EM | 3V | EM | 3V | EM | 3V | EM | 3V | 3V | 3V | 3V | 3V | EM | 3V | EM | 3V | EM | 3V | EM | 3V | EM | 3V | EM | 3V | EM | 3V | EM | 3V | EM | 3V | EM | 3V | EM | 3V | EM | 3V | EM | 3V | 3V | GND | 5V | GND | 3V | GND | GND | GND | GND | GND | 3V | 3V | 3V | 3V | 3V | 3V | GND | GND | 3V | GND | 3V | GND | 3V | GND | 3V | GND | 3V | GND | GND | GND | GND | GND | GND | 3V | 1 | 2 | 3 | 4 | 5 | 6 | 7 | 8 | 9 | 10 | 11 | 12 | 13 | 14 | 15 | 16 | 17 | 18 | 19 | 20 | 22 | 21 | 23 | 24